# Altium project master.PrjPcb (part 1 of 4)
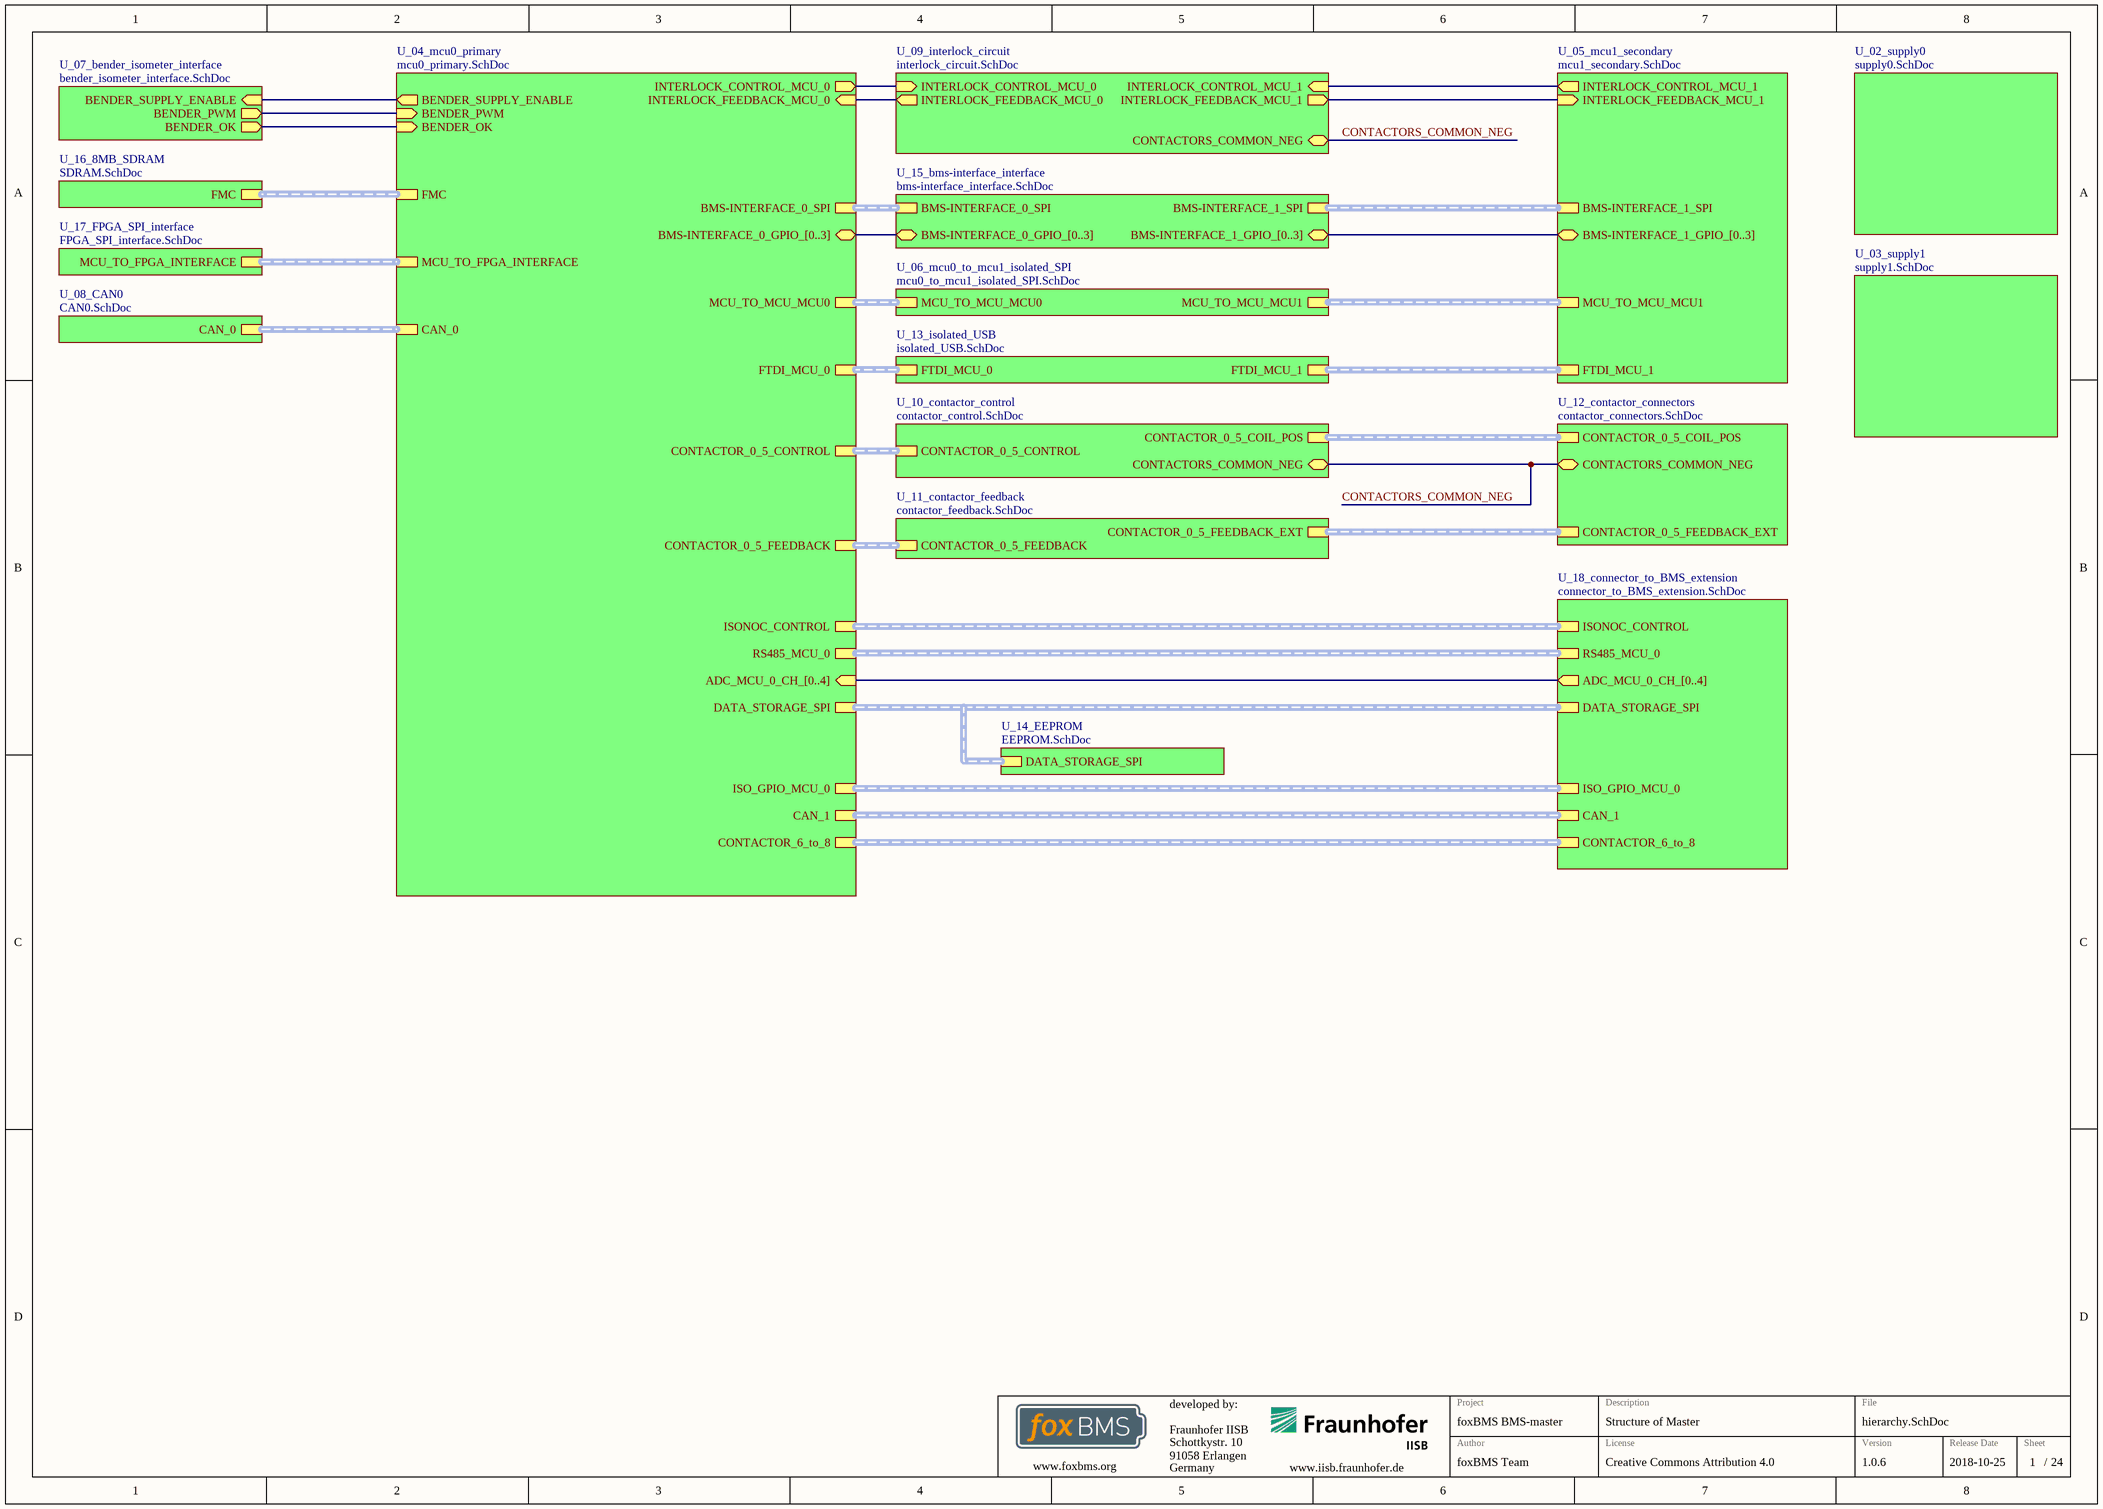
[diagram p0: hierarchy.SchDoc]
GlobalDate: 2018-10-25; GlobalLicense: Creative Commons Attribution 4.0; GlobalProject: foxBMS BMS-master; GlobalVersion: 1.0.6
24 sheets, 318 parts. Net scope: hierarchical (ports join the sheet entries above them; power ports are global).
Board file: master.PcbDoc
Sheets:
  hierarchy.SchDoc
    U_17_FPGA_SPI_interface = FPGA_SPI_interface.SchDoc
    U_02_supply0 = supply0.SchDoc
    U_03_supply1 = supply1.SchDoc
    U_04_mcu0_primary = mcu0_primary.SchDoc
      U_0403_crystals = crystals.SchDoc
      U_0404_debug_LED = debug_LED.SchDoc
      U_0405_ext_bootload_activation = ext_bootload_activation.SchDoc
      U_0400_power = power.SchDoc
        U_0401_adc_reference = adc_reference.SchDoc
        U_0402_analog_supply_decoupling = analog_supply_decoupling.SchDoc
    U_16_8MB_SDRAM = SDRAM.SchDoc
    U_08_CAN0 = CAN0.SchDoc
    U_06_mcu0_to_mcu1_isolated_SPI = mcu0_to_mcu1_isolated_SPI.SchDoc
    U_07_bender_isometer_interface = bender_isometer_interface.SchDoc
    U_13_isolated_USB = isolated_USB.SchDoc
    U_05_mcu1_secondary = mcu1_secondary.SchDoc
    U_18_connector_to_BMS_extension = connector_to_BMS_extension.SchDoc
    U_09_interlock_circuit = interlock_circuit.SchDoc
    U_10_contactor_control = contactor_control.SchDoc
    U_11_contactor_feedback = contactor_feedback.SchDoc
    U_12_contactor_connectors = contactor_connectors.SchDoc
    U_14_EEPROM = EEPROM.SchDoc
    U_15_bms-interface_interface = bms-interface_interface.SchDoc

## Sheet hierarchy.SchDoc
size A3; DocumentNumber: 1; SheetNumber: 1; SheetTotal: 24; SheetDescription: Structure of Master

### Sub-sheets
U_02_supply0 = supply0.SchDoc: no entries
U_03_supply1 = supply1.SchDoc: no entries
U_04_mcu0_primary = mcu0_primary.SchDoc: MCU_TO_FPGA_INTERFACE (harness SPI), FMC (harness FMC), CAN_1 (harness CAN), CAN_0 (harness CAN), MCU_TO_MCU_MCU0 (harness SPI), BENDER_SUPPLY_ENABLE (out), BENDER_PWM (in), BENDER_OK (in), FTDI_MCU_0 (harness FTDI), CONTACTOR_6_to_8 (harness CONTACTOR_6_to_8), INTERLOCK_FEEDBACK_MCU_0 (in), INTERLOCK_CONTROL_MCU_0 (out), DATA_STORAGE_SPI (harness DATA_STORAGE_SPI), CONTACTOR_0_5_FEEDBACK (harness CONTACTOR_0_TO_5), CONTACTOR_0_5_CONTROL (harness CONTACTOR_0_TO_5), BMS-INTERFACE_0_SPI (harness SPI), BMS-INTERFACE_0_GPIO_[0..3] (bidir, harness CAN), ADC_MCU_0_CH_[0..4] (in), RS485_MCU_0 (harness RS485), ISONOC_CONTROL (harness ISONOC_CONTROL), ISO_GPIO_MCU_0 (harness ISO_GPIO)
U_05_mcu1_secondary = mcu1_secondary.SchDoc: INTERLOCK_FEEDBACK_MCU_1 (in), INTERLOCK_CONTROL_MCU_1 (out), FTDI_MCU_1 (harness FTDI), MCU_TO_MCU_MCU1 (harness SPI), BMS-INTERFACE_1_SPI (harness SPI), BMS-INTERFACE_1_GPIO_[0..3] (bidir)
U_06_mcu0_to_mcu1_isolated_SPI = mcu0_to_mcu1_isolated_SPI.SchDoc: MCU_TO_MCU_MCU0 (harness SPI), MCU_TO_MCU_MCU1 (harness SPI)
U_07_bender_isometer_interface = bender_isometer_interface.SchDoc: BENDER_SUPPLY_ENABLE (in), BENDER_OK (out), BENDER_PWM (out)
U_08_CAN0 = CAN0.SchDoc: CAN_0 (harness CAN)
U_09_interlock_circuit = interlock_circuit.SchDoc: INTERLOCK_CONTROL_MCU_1 (in), INTERLOCK_FEEDBACK_MCU_0 (out), INTERLOCK_FEEDBACK_MCU_1 (out), CONTACTORS_COMMON_NEG (bidir), INTERLOCK_CONTROL_MCU_0 (in)
U_10_contactor_control = contactor_control.SchDoc: CONTACTORS_COMMON_NEG (bidir), CONTACTOR_0_5_COIL_POS (harness CONTACTOR_0_TO_5), CONTACTOR_0_5_CONTROL (harness CONTACTOR_0_TO_5)
U_11_contactor_feedback = contactor_feedback.SchDoc: CONTACTOR_0_5_FEEDBACK_EXT (harness CONTACTOR_0_TO_5), CONTACTOR_0_5_FEEDBACK (harness CONTACTOR_0_TO_5)
U_12_contactor_connectors = contactor_connectors.SchDoc: CONTACTORS_COMMON_NEG (bidir), CONTACTOR_0_5_COIL_POS (harness CONTACTOR_0_TO_5), CONTACTOR_0_5_FEEDBACK_EXT (harness CONTACTOR_0_TO_5)
U_13_isolated_USB = isolated_USB.SchDoc: FTDI_MCU_0 (harness FTDI), FTDI_MCU_1 (harness FTDI)
U_14_EEPROM = EEPROM.SchDoc: DATA_STORAGE_SPI (harness DATA_STORAGE_SPI)
U_15_bms-interface_interface = bms-interface_interface.SchDoc: BMS-INTERFACE_0_SPI (harness SPI), BMS-INTERFACE_1_SPI (harness SPI), BMS-INTERFACE_0_GPIO_[0..3] (bidir), BMS-INTERFACE_1_GPIO_[0..3] (bidir)
U_16_8MB_SDRAM = SDRAM.SchDoc: FMC (harness FMC)
U_17_FPGA_SPI_interface = FPGA_SPI_interface.SchDoc: MCU_TO_FPGA_INTERFACE (harness SPI)
U_18_connector_to_BMS_extension = connector_to_BMS_extension.SchDoc: CAN_1 (harness CAN), CONTACTOR_6_to_8 (harness CONTACTOR_6_to_8), DATA_STORAGE_SPI (harness DATA_STORAGE_SPI), ADC_MCU_0_CH_[0..4] (out), RS485_MCU_0 (harness RS485), ISONOC_CONTROL (harness ISONOC_CONTROL), ISO_GPIO_MCU_0 (harness ISO_GPIO)

### Nets
BENDER_OK: sheet U_04_mcu0_primary/BENDER_OK, sheet U_07_bender_isometer_interface/BENDER_OK
BENDER_PWM: sheet U_04_mcu0_primary/BENDER_PWM, sheet U_07_bender_isometer_interface/BENDER_PWM
BENDER_SUPPLY_ENABLE: sheet U_04_mcu0_primary/BENDER_SUPPLY_ENABLE, sheet U_07_bender_isometer_interface/BENDER_SUPPLY_ENABLE
CONTACTORS_COMMON_NEG: sheet U_09_interlock_circuit/CONTACTORS_COMMON_NEG, sheet U_10_contactor_control/CONTACTORS_COMMON_NEG, sheet U_12_contactor_connectors/CONTACTORS_COMMON_NEG
INTERLOCK_CONTROL_MCU_0: sheet U_04_mcu0_primary/INTERLOCK_CONTROL_MCU_0, sheet U_09_interlock_circuit/INTERLOCK_CONTROL_MCU_0
INTERLOCK_CONTROL_MCU_1: sheet U_05_mcu1_secondary/INTERLOCK_CONTROL_MCU_1, sheet U_09_interlock_circuit/INTERLOCK_CONTROL_MCU_1
INTERLOCK_FEEDBACK_MCU_0: sheet U_04_mcu0_primary/INTERLOCK_FEEDBACK_MCU_0, sheet U_09_interlock_circuit/INTERLOCK_FEEDBACK_MCU_0
INTERLOCK_FEEDBACK_MCU_1: sheet U_05_mcu1_secondary/INTERLOCK_FEEDBACK_MCU_1, sheet U_09_interlock_circuit/INTERLOCK_FEEDBACK_MCU_1

### Buses and harness runs
bus sheet U_04_mcu0_primary/ADC_MCU_0_CH_[0..4] = sheet U_18_connector_to_BMS_extension/ADC_MCU_0_CH_[0..4]
bus sheet U_05_mcu1_secondary/BMS-INTERFACE_1_GPIO_[0..3] = sheet U_15_bms-interface_interface/BMS-INTERFACE_1_GPIO_[0..3]
harness sheet U_04_mcu0_primary/BMS-INTERFACE_0_SPI = sheet U_15_bms-interface_interface/BMS-INTERFACE_0_SPI
harness sheet U_04_mcu0_primary/CAN_0 = sheet U_08_CAN0/CAN_0
harness sheet U_04_mcu0_primary/CAN_1 = sheet U_18_connector_to_BMS_extension/CAN_1
harness sheet U_04_mcu0_primary/CONTACTOR_0_5_CONTROL = sheet U_10_contactor_control/CONTACTOR_0_5_CONTROL
harness sheet U_04_mcu0_primary/CONTACTOR_0_5_FEEDBACK = sheet U_11_contactor_feedback/CONTACTOR_0_5_FEEDBACK
harness sheet U_04_mcu0_primary/CONTACTOR_6_to_8 = sheet U_18_connector_to_BMS_extension/CONTACTOR_6_to_8
harness sheet U_04_mcu0_primary/DATA_STORAGE_SPI = sheet U_14_EEPROM/DATA_STORAGE_SPI = sheet U_18_connector_to_BMS_extension/DATA_STORAGE_SPI
harness sheet U_04_mcu0_primary/FMC = sheet U_16_8MB_SDRAM/FMC
harness sheet U_04_mcu0_primary/FTDI_MCU_0 = sheet U_13_isolated_USB/FTDI_MCU_0
harness sheet U_04_mcu0_primary/ISO_GPIO_MCU_0 = sheet U_18_connector_to_BMS_extension/ISO_GPIO_MCU_0
harness sheet U_04_mcu0_primary/ISONOC_CONTROL = sheet U_18_connector_to_BMS_extension/ISONOC_CONTROL
harness sheet U_04_mcu0_primary/MCU_TO_FPGA_INTERFACE = sheet U_17_FPGA_SPI_interface/MCU_TO_FPGA_INTERFACE
harness sheet U_04_mcu0_primary/MCU_TO_MCU_MCU0 = sheet U_06_mcu0_to_mcu1_isolated_SPI/MCU_TO_MCU_MCU0
harness sheet U_04_mcu0_primary/RS485_MCU_0 = sheet U_18_connector_to_BMS_extension/RS485_MCU_0
harness sheet U_05_mcu1_secondary/BMS-INTERFACE_1_SPI = sheet U_15_bms-interface_interface/BMS-INTERFACE_1_SPI
harness sheet U_05_mcu1_secondary/FTDI_MCU_1 = sheet U_13_isolated_USB/FTDI_MCU_1
harness sheet U_05_mcu1_secondary/MCU_TO_MCU_MCU1 = sheet U_06_mcu0_to_mcu1_isolated_SPI/MCU_TO_MCU_MCU1
harness sheet U_10_contactor_control/CONTACTOR_0_5_COIL_POS = sheet U_12_contactor_connectors/CONTACTOR_0_5_COIL_POS
harness sheet U_11_contactor_feedback/CONTACTOR_0_5_FEEDBACK_EXT = sheet U_12_contactor_connectors/CONTACTOR_0_5_FEEDBACK_EXT

### Notes on the sheet
- Fraunhofer IISB
- Schottkystr. 10
- developed by:
- 91058 Erlangen
- Germany
- Author
- Project
- License
- Description
- File
- Version
- Release Date
- Sheet
- www.foxbms.org
- www.iisb.fraunhofer.de
- foxBMS Team
- /

## Sheet FPGA_SPI_interface.SchDoc: foxBMS BMS-Master
size A3; DocumentNumber: 23; SheetNumber: 23; SheetTotal: 24; Author: Fraunhofer IISB foxBMS Team; REL-DATE: 2017-05-16; VERSION: 1.0.2; SheetDescription: FPGA SPI Interface up to 45MHz
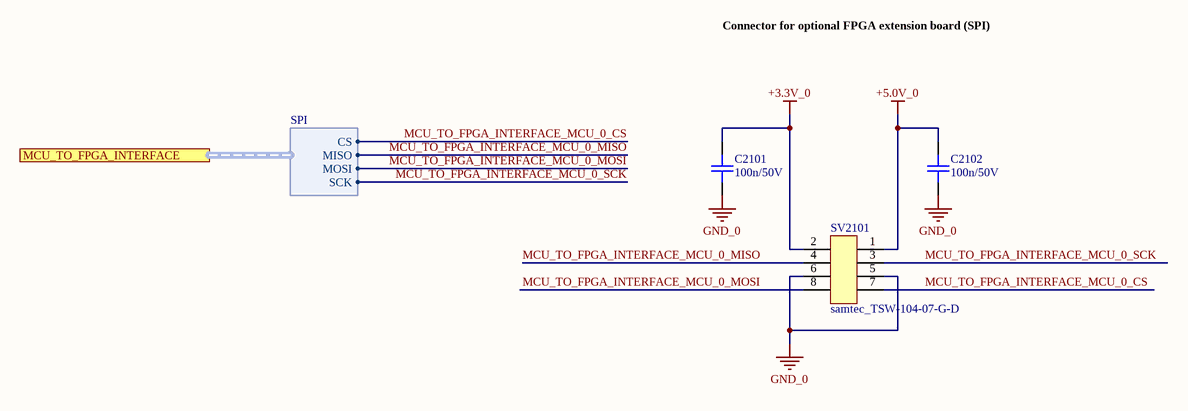
[diagram p1: FPGA_SPI_interface.SchDoc]

### Parts
C2101  100n/50V  [CAPC1608X08N]
C2102  100n/50V  [CAPC1608X08N]
SV2101  samtec_TSW-104-07-G-D  [Pinheader_2.54_2x4]

### Ports
MCU_TO_FPGA_INTERFACE (harness SPI)

### Harnesses
SPI: CS, MISO, MOSI, SCK

### Nets
+3.3V_0: C2101.2 SV2101.2
+5.0V_0: C2102.1 SV2101.1
GND_0: C2101.1 C2102.2 SV2101.5 SV2101.6
MCU_TO_FPGA_INTERFACE_MCU_0_CS: SV2101.7 ; port MCU_TO_FPGA_INTERFACE.CS
MCU_TO_FPGA_INTERFACE_MCU_0_MISO: SV2101.4 ; port MCU_TO_FPGA_INTERFACE.MISO
MCU_TO_FPGA_INTERFACE_MCU_0_MOSI: SV2101.8 ; port MCU_TO_FPGA_INTERFACE.MOSI
MCU_TO_FPGA_INTERFACE_MCU_0_SCK: SV2101.3 ; port MCU_TO_FPGA_INTERFACE.SCK

### Notes on the sheet
- Connector for optional FPGA extension board (SPI)
- Fraunhofer IISB
- Schottkystr. 10
- developed by:
- 91058 Erlangen
- Germany
- Author
- Project
- License
- Description
- File
- Version
- Release Date
- Sheet
- www.foxbms.org
- www.iisb.fraunhofer.de
- foxBMS Team
- /

### Library data of the parts
C2101 C2102 = gen_C_ceramic_100n_50V_X7R_0603: MLCC; Capacitance: 100n; Rated Voltage: 50V; Dielectric: X7R; Case EIA: 0603; Case Metric: 1608; PnP Package: C_0603_10; PnP Value: 100n/50V/X7R; PnP equipped: x; Automotive Qualified: False; Part Number: gen_C_ceramic_100n_50V_X7R_0603; Supplier 1: Farnell; Supplier Part Number 1: 2525267; Supplier 2: Digikey; Supplier Part Number 2: 490-6049-1-ND
SV2101 = samtec_TSW-104-07-G-D: Board-To-Board Connector, Vertical, 2.54 mm, 8 Contacts, Header, TSW Series, Through Hole, 2 Rows; Manufacturer: Samtec; Circuits: 8; Rated Voltage: 500V AC mated with SSW; Automotive Qualified: False; Part Number: samtec_TSW-104-07-G-D; Part Name: TSW-104-07-G-D; Operating Temperature: -55°C - +125°C; ComponentLink1Description: Datasheet; ComponentLink1URL: http://www.farnell.com/datasheets/1992055.pdf; Supplier 1: Farnell; Supplier Part Number 1: 2025250

## Sheet supply0.SchDoc: foxBMS BMS-Master
size A3; DocumentNumber: 2; SheetNumber: 2; SheetTotal: 24; Author: Fraunhofer IISB foxBMS Team; REL-DATE: 2017-05-16; VERSION: 1.0.2; SheetDescription: Supply for MCU0 and peripherals
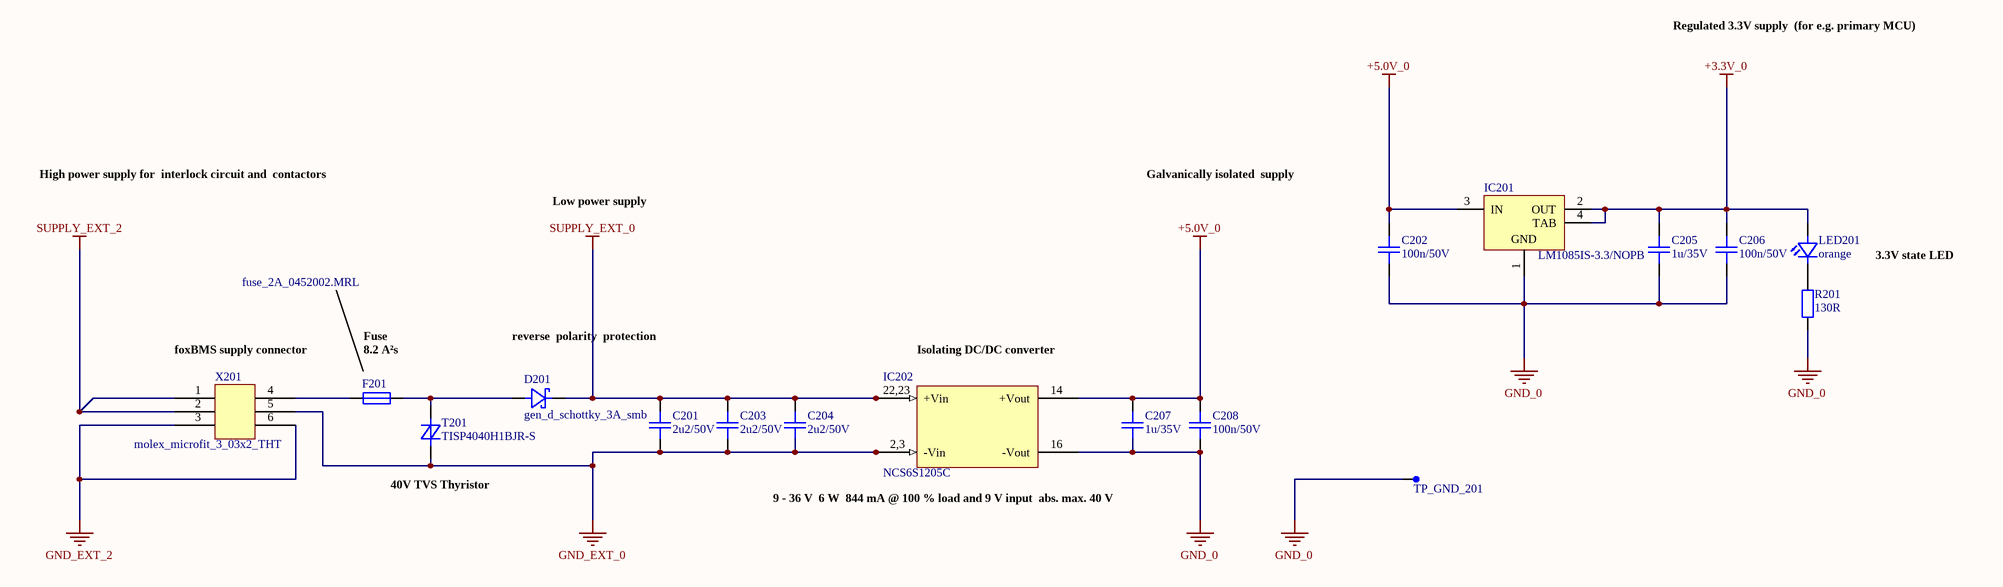
[diagram p2: supply0.SchDoc]

### Parts
C201  2u2/50V  [CAPC2012X14N]
C202  100n/50V  [CAPC1608X08N]
C203  2u2/50V  [CAPC2012X14N]
C204  2u2/50V  [CAPC2012X14N]
C205  1u/35V  [CAPC1608X08N]
C206  100n/50V  [CAPC1608X08N]
C207  1u/35V  [CAPC1608X08N]
C208  100n/50V  [CAPC1608X08N]
D201  gen_d_schottky_3A_smb  [SMB]
F201  fuse_2A_0452002.MRL  [LITTLEFUSE_452_454]
IC201  LM1085IS-3.3/NOPB  [KTT0003B_N]
IC202  NCS6S1205C  [NCS6S1205C]
LED201  orange  [LEDC1608X07N]
R201  130R  [RESC1608X05N]
T201  TISP4040H1BJR-S  [SMB]
TP_GND_201  Testpoint_Round  [Testpoint_D1V]  (value not drawn)  (no BOM)
X201  molex_microfit_3_03x2_THT  [MOLEX_MICROFIT_03x2_THT]

### Nets
+3.3V_0: C205.1 C206.1 IC201.2(OUT) IC201.4(TAB) LED201.2(A)
+5.0V_0: C202.1 C207.1 C208.1 IC201.3(IN) IC202.14(+Vout)
GND_0: C202.2 C205.2 C206.2 C207.2 C208.2 IC201.1(GND) IC202.16(-Vout) R201.1 TP_GND_201.1
GND_EXT_0: C201.2 C203.2 C204.2 IC202.2(-Vin) IC202.3(-Vin) T201.2(T(A)) X201.5
GND_EXT_2: X201.3 X201.6
SUPPLY_EXT_0: C201.1 C203.1 C204.1 D201.1(K) IC202.22(+Vin) IC202.23(+Vin)
SUPPLY_EXT_2: X201.1 X201.2
NetD201_2: D201.2(A) F201.2 T201.1(R(B))
NetF201_1: F201.1 X201.4
NetLED201_1: LED201.1(C) R201.2

### Notes on the sheet
- Regulated 3.3V supply
  (for e.g. primary MCU)
- High power supply for
  interlock circuit and
  contactors
- Galvanically isolated
  supply
- Low power supply
- 3.3V state LED
- foxBMS supply connector
- Fuse
- (near F201) 8.2 A²s
- reverse
  polarity
  protection
- (near IC202) Isolating DC/DC converter
- (near T201) 40V TVS Thyristor
- 9 - 36 V
  6 W
  844 mA @ 100 % load and 9 V input
  abs. max. 40 V
- Fraunhofer IISB
- Schottkystr. 10
- developed by:
- 91058 Erlangen
- Germany
- Author
- Project
- License
- Description
- File
- Version
- Release Date
- Sheet
- www.foxbms.org
- www.iisb.fraunhofer.de
- foxBMS Team
- /
- (in symbol NCS6S1205C) 22,23; 2,3

### Library data of the parts
C201 C203 C204 = gen_C_ceramic_2u2_50V_X7R_0805: MLCC; Capacitance: 2u2; Rated Voltage: 50V; Dielectric: X7R; Case EIA: 0805; Case Metric: 2012; Automotive Qualified: False; Part Number: gen_C_ceramic_2u2_50V_X7R_0805; Supplier 1: Farnell; Supplier Part Number 1: 2547054
C202 C206 C208 = gen_C_ceramic_100n_50V_X7R_0603: as C2101 on sheet FPGA_SPI_interface; Part Number: gen_C_ceramic_100n_50V_X7R_0603; Supplier 1: Farnell; Supplier Part Number 1: 2525267; Supplier 2: Digikey; Supplier Part Number 2: 490-6049-1-ND
C205 C207 = gen_C_ceramic_1u_35V_X7R_0603: MLCC; Capacitance: 1u; Rated Voltage: 35V; Dielectric: X7R; Case EIA: 0603; Case Metric: 1608; PnP Package: C_0603_10; PnP Value: 1uF/35V/X7R; PnP equipped: x; Automotive Qualified: False; Part Number: gen_C_ceramic_1u_35V_X7R_0603; Supplier 1: Farnell; Supplier Part Number 1: 1907508
D201 = gen_d_schottky_3A_smb: Schottky Diode; Part Name: e.g. STPS3L60U; Manufacturer: e.g. ST Microelectronics; Continuous Forward Current: 3A; Automotive Qualified: False; Part Number: gen_d_schottky_3A_smb; ComponentLink1Description: Datasheet; ComponentLink1URL: http://www.farnell.com/datasheets/1671123.pdf; Supplier 1: Farnell; Supplier Part Number 1: 9907769
F201 = fuse_2A_0452002.MRL: Littlefuse NANO SLO-BLO Fuse 2A 8.20A²s 0452002.MRL; Automotive Qualified: False; Part Number: fuse_2A_0452002.MRL; Manufacturer: Littlefuse; Operating Temperature: -55°C - +125°C; ComponentLink1Description: Datasheet; ComponentLink1URL: http://www.farnell.com/datasheets/2108446.pdf; Supplier 1: Farnell; Supplier Part Number 1: 2383284
IC201 = CMP-0062-00578-5: 3A Low Dropout Positive Regulators, 3-pin TO-263, Pb-Free; Manufacturer: Texas Instruments; High-Reliability: Y; PowerWise: N; CompType: LDO IC; PackageTopMarking: NSUZXYTTE#*LM1085*IS-3.3; PartNumber: LM1085IS-3.3/NOPB; ComponentLink1Description: Datasheet URL; Code_JEDEC: MO-169-AA; PinCount: 3; RoHS: Y; PackageReference: KTT0003B; ComponentLink1URL: http://www.ti.com/general/docs/lit/getliterature.tsp?genericPartNumber=LM1085&fileType=pdf; PackageDescription: TO-263, Molded, .400 x .390 x .180in, 3 Lead, .1in Pitch, Surface Mount
IC202 = NCS6S1205C: Murata Isolated 6W 4:1 Input Single Output DC/DC Converter; Manufacturer: Murata Power Solutions Inc.; Automotive Qualified: False; Part Number: NCS6S1205C; Operating Temperature: -40°C - +85°C; ComponentLink1Description: Datasheet; ComponentLink1URL: https://power.murata.com/data/power/ncl/kdc_ncs6.pdf; ComponentLink2Description: 3D PDF; ComponentLink2URL: https://power.murata.com/3d/dcdc/mps_dcdc_ncs6s_a.pdf; Supplier 1: Digikey; Supplier Part Number 1: 811-2109-5-ND
LED201 = gen_LED_0603_orange: LED; Breakdown Voltage: 5V; Continuous Forward Current: 20mA; Forward Voltage @ 20mA: 2.2V; Automotive Qualified: False; Part Number: gen_LED_0603_orange; Color: orange; PnP Package: LED_0603; Supplier 1: Farnell; Supplier Part Number 1: 2099222
R201 = gen_R_130R_0603: SMD Resistor 130R 0603; Tolerance: 1%; Power: 0.1W; Case EIA: 0603; Case Metric: 1608; Maximum Working Voltage: 75V; PnP Package: R_0603; Automotive Qualified: False; Part Number: gen_R_130R_0603; Operating Temperature: -55°C - +155°C; Resistance: 130R; Series: E24, E96; PnP Value: 130R; Supplier 1: Farnell; Supplier Part Number 1: 2379959
T201 = TISP4040H1BJR-S: BIDIRECTIONAL THYRISTOR OVERVOLTAGE PROTECTOR; Manufacturer: Bourns; Automotive Qualified: False; Part Number: TISP4040H1BJR-S; Operating Temperature: -40°C - +150°C; ComponentLink1Description: Datasheet; ComponentLink1URL: http://www.bourns.com/data/global/pdfs/TISP40xxH1BJ.pdf; Supplier 1: Digikey; Supplier Part Number 1: TISP4040H1BJR-SCT-ND
TP_GND_201 = Testpoint_Round_Via: Testpoint, Via, round; Part Number: Testpoint_Round_Via
X201 = molex_microfit_3_03x2_THT: Micro-Fit 3.0 Right Angle Header, 3.00mm Pitch, Dual Row, 6 Circuits, with Snap-in Plastic Peg PCB Lock, Tin, Glow Wire Capable, Black, 43045-0600; Manufacturer: Molex; Circuits: 6; Rated Voltage: 600V; Rated Current: 8.5A; Automotive Qualified: False; Part Number: molex_microfit_3_03x2_THT; Part Name: MicroFit; Operating Temperature: -40°C - +105°C; Supplier 1: Farnell; Supplier Part Number 1: 1012252

## Sheet supply1.SchDoc: foxBMS BMS-Master
size A3; DocumentNumber: 3; SheetNumber: 3; SheetTotal: 24; Author: Fraunhofer IISB foxBMS Team; REL-DATE: 2017-05-16; VERSION: 1.0.2; SheetDescription: Supply for MCU1 and peripherals
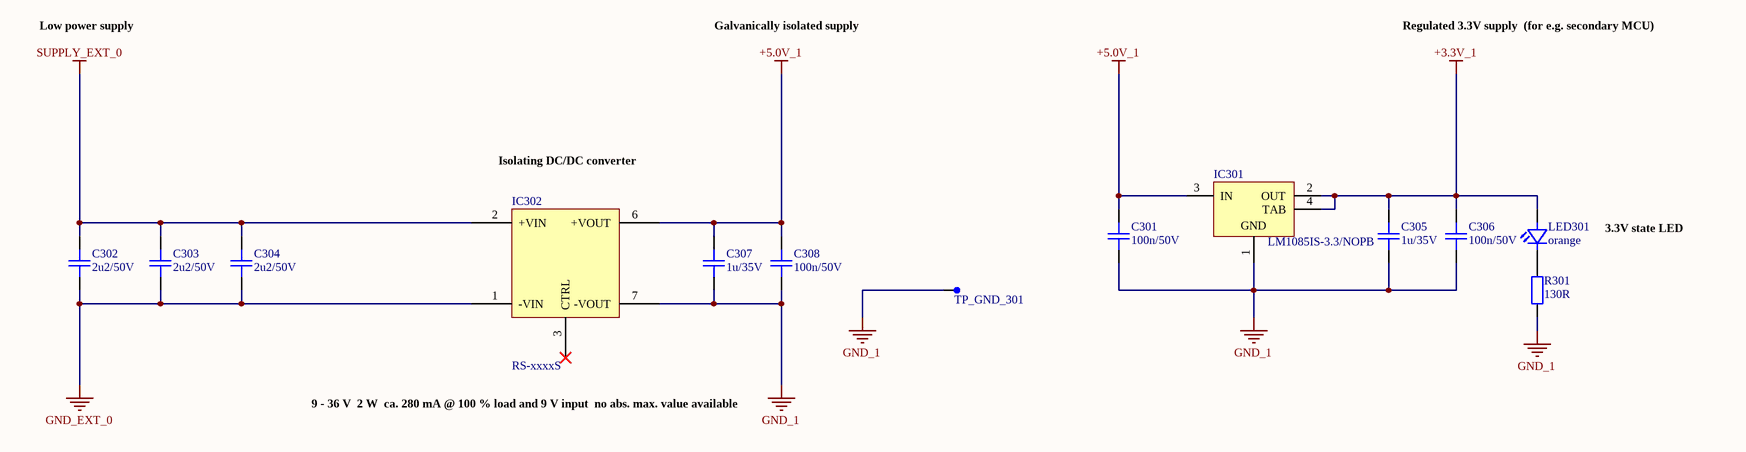
[diagram p3: supply1.SchDoc]

### Parts
C301  100n/50V  [CAPC1608X08N]
C302  2u2/50V  [CAPC2012X14N]
C303  2u2/50V  [CAPC2012X14N]
C304  2u2/50V  [CAPC2012X14N]
C305  1u/35V  [CAPC1608X08N]
C306  100n/50V  [CAPC1608X08N]
C307  1u/35V  [CAPC1608X08N]
C308  100n/50V  [CAPC1608X08N]
IC301  LM1085IS-3.3/NOPB  [KTT0003B_N]
IC302  RS-xxxxS  [RECOM_RS-S_D]
LED301  orange  [LEDC1608X07N]
R301  130R  [RESC1608X05N]
TP_GND_301  Testpoint_Round  [Testpoint_D1V]  (value not drawn)  (no BOM)

### Nets
+3.3V_1: C305.1 C306.1 IC301.2(OUT) IC301.4(TAB) LED301.2(A)
+5.0V_1: C301.1 C307.1 C308.1 IC301.3(IN) IC302.6(+VOUT)
GND_1: C301.2 C305.2 C306.2 C307.2 C308.2 IC301.1(GND) IC302.7(-VOUT) R301.2 TP_GND_301.1
GND_EXT_0: C302.2 C303.2 C304.2 IC302.1(-VIN)
SUPPLY_EXT_0: C302.1 C303.1 C304.1 IC302.2(+VIN)
NetLED301_1: LED301.1(C) R301.1

Not connected (* = marked no-connect by the designer): IC302 3(CTRL)*

### Notes on the sheet
- Low power supply
- Galvanically isolated supply
- Regulated 3.3V supply
  (for e.g. secondary MCU)
- Isolating DC/DC converter
- 3.3V state LED
- 9 - 36 V
  2 W
  ca. 280 mA @ 100 % load and 9 V input
  no abs. max. value available
- Fraunhofer IISB
- Schottkystr. 10
- developed by:
- 91058 Erlangen
- Germany
- Author
- Project
- License
- Description
- File
- Version
- Release Date
- Sheet
- www.foxbms.org
- www.iisb.fraunhofer.de
- foxBMS Team
- /

### Library data of the parts
C301 C306 C308 = gen_C_ceramic_100n_50V_X7R_0603: as C2101 on sheet FPGA_SPI_interface; Part Number: gen_C_ceramic_100n_50V_X7R_0603; Supplier 1: Farnell; Supplier Part Number 1: 2525267; Supplier 2: Digikey; Supplier Part Number 2: 490-6049-1-ND
C302-C304 = gen_C_ceramic_2u2_50V_X7R_0805: as C201 on sheet supply0; Part Number: gen_C_ceramic_2u2_50V_X7R_0805; Supplier 1: Farnell; Supplier Part Number 1: 2547054
C305 C307 = gen_C_ceramic_1u_35V_X7R_0603: as C205 on sheet supply0; Part Number: gen_C_ceramic_1u_35V_X7R_0603; Supplier 1: Farnell; Supplier Part Number 1: 1907508
IC301 = CMP-0062-00578-5: as IC201 on sheet supply0; PartNumber: LM1085IS-3.3/NOPB; ComponentLink1Description: Datasheet URL; Code_JEDEC: MO-169-AA; PinCount: 3; RoHS: Y; PackageReference: KTT0003B; ComponentLink1URL: http://www.ti.com/general/docs/lit/getliterature.tsp?genericPartNumber=LM1085&fileType=pdf; PackageDescription: TO-263, Molded, .400 x .390 x .180in, 3 Lead, .1in Pitch, Surface Mount
IC302 = Recom_RS-2405SZ/H3: Isolating DC/DC Converter; Manufacturer: Recom; Automotive Qualified: False; Part Number: Recom_RS-2405SZ/H3; ComponentLink1Description: Datasheet; ComponentLink1URL: https://www.recom-power.com/pdf/Econoline/RS-S_D_Z.pdf; Supplier 1: Digikey; Supplier Part Number 1: 945-1552-5-ND; Supplier 2: Farnell; Supplier Part Number 2: 1893731; Supplier 3: Mouser; Supplier Part Number 3: 919-RS-2405SZ/H3
LED301 = gen_LED_0603_orange: as LED201 on sheet supply0; Part Number: gen_LED_0603_orange; Color: orange; PnP Package: LED_0603; Supplier 1: Farnell; Supplier Part Number 1: 2099222
R301 = gen_R_130R_0603: as R201 on sheet supply0; Part Number: gen_R_130R_0603; Operating Temperature: -55°C - +155°C; Resistance: 130R; Series: E24, E96; PnP Value: 130R; Supplier 1: Farnell; Supplier Part Number 1: 2379959
TP_GND_301 = Testpoint_Round_Via: Testpoint, Via, round; Part Number: Testpoint_Round_Via

## Sheet mcu0_primary.SchDoc: foxBMS BMS-Master
size A3; DocumentNumber: 4; SheetNumber: 4; SheetTotal: 24; Author: Fraunhofer IISB foxBMS Team; REL-DATE: 2017-05-16; VERSION: 1.0.2; SheetDescription: MCU0 (Primary)
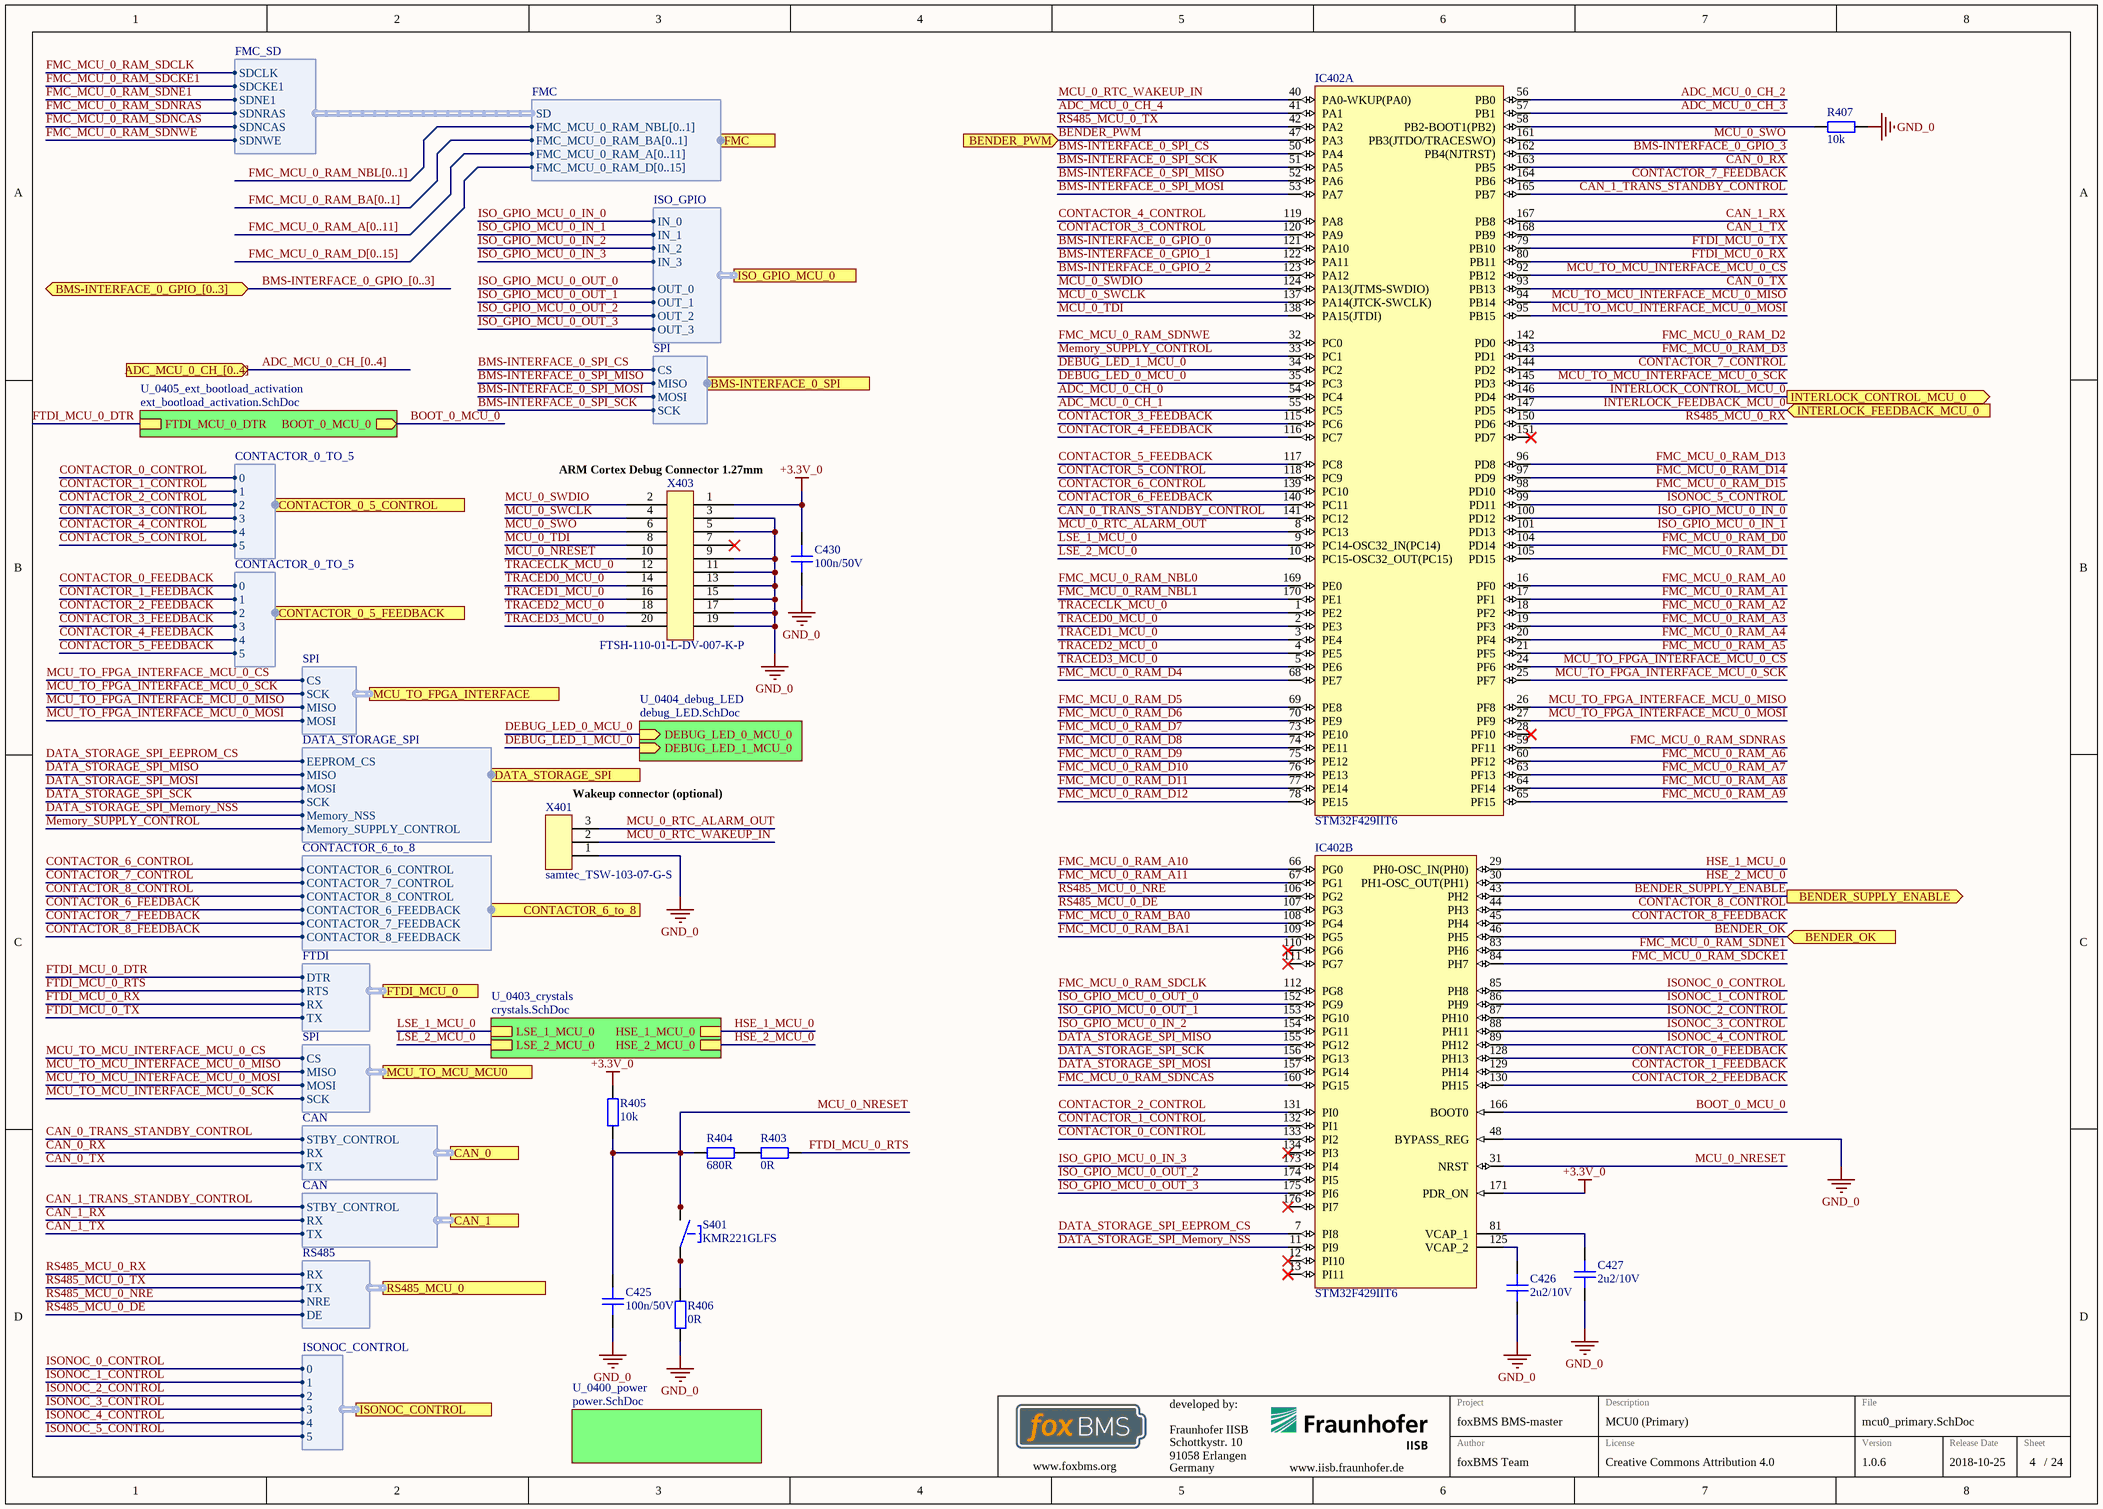
[diagram p4: mcu0_primary.SchDoc]

### Parts
C425  100n/50V  [CAPC1608X08N]
C426  2u2/10V  [CAPC1608X08N]
C427  2u2/10V  [CAPC1608X08N]
C430  100n/50V  [CAPC1608X08N]
IC402  STM32F429IIT6  [STM-LQFP176_N]  (parts A,B of 3)
R403  0R  [RESC1608X05N]
R404  680R  [RESC1608X05N]
R405  10k  [RESC1608X05N]
R406  0R  [RESC1608X05N]
R407  10k  [RESC1608X05N]
S401  KMR221GLFS  [KMR2_Series]
X401  samtec_TSW-103-07-G-S  [Pinheader_2.54_3]
X403  FTSH-110-01-L-DV-007-K-P  [CORTEX_DEBUG_20_PIN]

### Sub-sheets
U_0400_power = power.SchDoc: no entries
U_0403_crystals = crystals.SchDoc: LSE_1_MCU_0, LSE_2_MCU_0, HSE_1_MCU_0, HSE_2_MCU_0
U_0404_debug_LED = debug_LED.SchDoc: DEBUG_LED_0_MCU_0 (in), DEBUG_LED_1_MCU_0 (in)
U_0405_ext_bootload_activation = ext_bootload_activation.SchDoc: FTDI_MCU_0_DTR, BOOT_0_MCU_0 (out)

### Ports
ADC_MCU_0_CH_[0..4] (in), BENDER_OK (in), BENDER_PWM (in), BENDER_SUPPLY_ENABLE (out), BMS-INTERFACE_0_GPIO_[0..3] (bidir, harness CAN), BMS-INTERFACE_0_SPI (harness SPI), CAN_0 (harness CAN), CAN_1 (harness CAN), CONTACTOR_0_5_CONTROL (harness CONTACTOR_0_TO_5), CONTACTOR_0_5_FEEDBACK (harness CONTACTOR_0_TO_5), CONTACTOR_6_to_8 (harness CONTACTOR_6_to_8), DATA_STORAGE_SPI (harness DATA_STORAGE_SPI), FMC (harness FMC), FTDI_MCU_0 (harness FTDI), INTERLOCK_CONTROL_MCU_0 (out), INTERLOCK_FEEDBACK_MCU_0 (in), ISO_GPIO_MCU_0 (harness ISO_GPIO), ISONOC_CONTROL (harness ISONOC_CONTROL), MCU_TO_FPGA_INTERFACE (harness SPI), MCU_TO_MCU_MCU0 (harness SPI), RS485_MCU_0 (harness RS485)

### Harnesses
FMC_SD: SDCLK, SDCKE1, SDNE1, SDNRAS, SDNWE, SDNCAS
FMC: SD, FMC_MCU_0_RAM_NBL[0..1], FMC_MCU_0_RAM_BA[0..1], FMC_MCU_0_RAM_A[0..11], FMC_MCU_0_RAM_D[0..15]
SPI: CS, SCK, MISO, MOSI
DATA_STORAGE_SPI: EEPROM_CS, MISO, MOSI, SCK, Memory_NSS, Memory_SUPPLY_CONTROL
CONTACTOR_6_to_8: CONTACTOR_6_CONTROL, CONTACTOR_7_CONTROL, CONTACTOR_8_CONTROL, CONTACTOR_6_FEEDBACK, CONTACTOR_7_FEEDBACK, CONTACTOR_8_FEEDBACK
SPI: CS, MISO, MOSI, SCK
FTDI: DTR, RTS, RX, TX
CAN: STBY_CONTROL, RX, TX
RS485: RX, TX, NRE, DE
ISONOC_CONTROL: 0, 1, 2, 3, 4, 5
ISO_GPIO: IN_0, IN_1, IN_2, IN_3, OUT_3, OUT_0, OUT_1, OUT_2
CONTACTOR_0_TO_5: 0, 1, 2, 3, 4, 5

### Nets
+3.3V_0: C430.1 IC402.171(PDR_ON) R405.2 X403.1
GND_0: C425.2 C426.2 C427.2 C430.2 IC402.48(BYPASS_REG) R406.1 R407.1 X401.1 X403.3 X403.5 X403.9 X403.11 X403.13 X403.15 X403.17 X403.19
ADC_MCU_0_CH_0: IC402.54(PC4)
ADC_MCU_0_CH_1: IC402.55(PC5)
ADC_MCU_0_CH_2: IC402.56(PB0)
ADC_MCU_0_CH_3: IC402.57(PB1)
ADC_MCU_0_CH_4: IC402.41(PA1)
BENDER_OK: IC402.46(PH5) ; port BENDER_OK
BENDER_PWM: IC402.47(PA3) ; port BENDER_PWM
BENDER_SUPPLY_ENABLE: IC402.43(PH2) ; port BENDER_SUPPLY_ENABLE
BMS-INTERFACE_0_GPIO_0: IC402.121(PA10)
BMS-INTERFACE_0_GPIO_1: IC402.122(PA11)
BMS-INTERFACE_0_GPIO_2: IC402.123(PA12)
BMS-INTERFACE_0_GPIO_3: IC402.162(PB4(NJTRST))
BMS-INTERFACE_0_SPI_CS: IC402.50(PA4) ; port BMS-INTERFACE_0_SPI.CS
BMS-INTERFACE_0_SPI_MISO: IC402.52(PA6) ; port BMS-INTERFACE_0_SPI.MISO
BMS-INTERFACE_0_SPI_MOSI: IC402.53(PA7) ; port BMS-INTERFACE_0_SPI.MOSI
BMS-INTERFACE_0_SPI_SCK: IC402.51(PA5) ; port BMS-INTERFACE_0_SPI.SCK
BOOT_0_MCU_0: IC402.166(BOOT0) ; sheet U_0405_ext_bootload_activation/BOOT_0_MCU_0
CAN_0_RX: IC402.163(PB5) ; port CAN_0.RX
CAN_0_TRANS_STANDBY_CONTROL: IC402.141(PC12) ; port CAN_0.STBY_CONTROL
CAN_0_TX: IC402.93(PB13) ; port CAN_0.TX
CAN_1_RX: IC402.167(PB8) ; port CAN_1.RX
CAN_1_TRANS_STANDBY_CONTROL: IC402.165(PB7) ; port CAN_1.STBY_CONTROL
CAN_1_TX: IC402.168(PB9) ; port CAN_1.TX
CONTACTOR_0_CONTROL: IC402.133(PI2) ; port CONTACTOR_0_5_CONTROL.0
CONTACTOR_0_FEEDBACK: IC402.128(PH13) ; port CONTACTOR_0_5_FEEDBACK.0
CONTACTOR_1_CONTROL: IC402.132(PI1) ; port CONTACTOR_0_5_CONTROL.1
CONTACTOR_1_FEEDBACK: IC402.129(PH14) ; port CONTACTOR_0_5_FEEDBACK.1
CONTACTOR_2_CONTROL: IC402.131(PI0) ; port CONTACTOR_0_5_CONTROL.2
CONTACTOR_2_FEEDBACK: IC402.130(PH15) ; port CONTACTOR_0_5_FEEDBACK.2
CONTACTOR_3_CONTROL: IC402.120(PA9) ; port CONTACTOR_0_5_CONTROL.3
CONTACTOR_3_FEEDBACK: IC402.115(PC6) ; port CONTACTOR_0_5_FEEDBACK.3
CONTACTOR_4_CONTROL: IC402.119(PA8) ; port CONTACTOR_0_5_CONTROL.4
CONTACTOR_4_FEEDBACK: IC402.116(PC7) ; port CONTACTOR_0_5_FEEDBACK.4
CONTACTOR_5_CONTROL: IC402.118(PC9) ; port CONTACTOR_0_5_CONTROL.5
CONTACTOR_5_FEEDBACK: IC402.117(PC8) ; port CONTACTOR_0_5_FEEDBACK.5
CONTACTOR_6_CONTROL: IC402.139(PC10) ; port CONTACTOR_6_to_8.CONTACTOR_6_CONTROL
CONTACTOR_6_FEEDBACK: IC402.140(PC11) ; port CONTACTOR_6_to_8.CONTACTOR_6_FEEDBACK
CONTACTOR_7_CONTROL: IC402.144(PD2) ; port CONTACTOR_6_to_8.CONTACTOR_7_CONTROL
CONTACTOR_7_FEEDBACK: IC402.164(PB6) ; port CONTACTOR_6_to_8.CONTACTOR_7_FEEDBACK
CONTACTOR_8_CONTROL: IC402.44(PH3) ; port CONTACTOR_6_to_8.CONTACTOR_8_CONTROL
CONTACTOR_8_FEEDBACK: IC402.45(PH4) ; port CONTACTOR_6_to_8.CONTACTOR_8_FEEDBACK
DATA_STORAGE_SPI_EEPROM_CS: IC402.7(PI8) ; port DATA_STORAGE_SPI.EEPROM_CS
DATA_STORAGE_SPI_Memory_NSS: IC402.11(PI9) ; port DATA_STORAGE_SPI.Memory_NSS
DATA_STORAGE_SPI_MISO: IC402.155(PG12) ; port DATA_STORAGE_SPI.MISO
DATA_STORAGE_SPI_MOSI: IC402.157(PG14) ; port DATA_STORAGE_SPI.MOSI
DATA_STORAGE_SPI_SCK: IC402.156(PG13) ; port DATA_STORAGE_SPI.SCK
DEBUG_LED_0_MCU_0: IC402.35(PC3) ; sheet U_0404_debug_LED/DEBUG_LED_0_MCU_0
DEBUG_LED_1_MCU_0: IC402.34(PC2) ; sheet U_0404_debug_LED/DEBUG_LED_1_MCU_0
FMC_MCU_0_RAM_A0: IC402.16(PF0)
FMC_MCU_0_RAM_A1: IC402.17(PF1)
FMC_MCU_0_RAM_A2: IC402.18(PF2)
FMC_MCU_0_RAM_A3: IC402.19(PF3)
FMC_MCU_0_RAM_A4: IC402.20(PF4)
FMC_MCU_0_RAM_A5: IC402.21(PF5)
FMC_MCU_0_RAM_A6: IC402.60(PF12)
FMC_MCU_0_RAM_A7: IC402.63(PF13)
FMC_MCU_0_RAM_A8: IC402.64(PF14)
FMC_MCU_0_RAM_A9: IC402.65(PF15)
FMC_MCU_0_RAM_A10: IC402.66(PG0)
FMC_MCU_0_RAM_A11: IC402.67(PG1)
FMC_MCU_0_RAM_BA0: IC402.108(PG4)
FMC_MCU_0_RAM_BA1: IC402.109(PG5)
FMC_MCU_0_RAM_D0: IC402.104(PD14)
FMC_MCU_0_RAM_D1: IC402.105(PD15)
FMC_MCU_0_RAM_D2: IC402.142(PD0)
FMC_MCU_0_RAM_D3: IC402.143(PD1)
FMC_MCU_0_RAM_D4: IC402.68(PE7)
FMC_MCU_0_RAM_D5: IC402.69(PE8)
FMC_MCU_0_RAM_D6: IC402.70(PE9)
FMC_MCU_0_RAM_D7: IC402.73(PE10)
FMC_MCU_0_RAM_D8: IC402.74(PE11)
FMC_MCU_0_RAM_D9: IC402.75(PE12)
FMC_MCU_0_RAM_D10: IC402.76(PE13)
FMC_MCU_0_RAM_D11: IC402.77(PE14)
FMC_MCU_0_RAM_D12: IC402.78(PE15)
FMC_MCU_0_RAM_D13: IC402.96(PD8)
FMC_MCU_0_RAM_D14: IC402.97(PD9)
FMC_MCU_0_RAM_D15: IC402.98(PD10)
FMC_MCU_0_RAM_NBL0: IC402.169(PE0)
FMC_MCU_0_RAM_NBL1: IC402.170(PE1)
FMC_MCU_0_RAM_SDCKE1: IC402.84(PH7) ; harness FMC_SD.SDCKE1
FMC_MCU_0_RAM_SDCLK: IC402.112(PG8) ; harness FMC_SD.SDCLK
FMC_MCU_0_RAM_SDNCAS: IC402.160(PG15) ; harness FMC_SD.SDNCAS
FMC_MCU_0_RAM_SDNE1: IC402.83(PH6) ; harness FMC_SD.SDNE1
FMC_MCU_0_RAM_SDNRAS: IC402.59(PF11) ; harness FMC_SD.SDNRAS
FMC_MCU_0_RAM_SDNWE: IC402.32(PC0) ; harness FMC_SD.SDNWE
FTDI_MCU_0_DTR: sheet U_0405_ext_bootload_activation/FTDI_MCU_0_DTR, port FTDI_MCU_0.DTR
FTDI_MCU_0_RTS: R403.2 ; port FTDI_MCU_0.RTS
FTDI_MCU_0_RX: IC402.80(PB11) ; port FTDI_MCU_0.RX
FTDI_MCU_0_TX: IC402.79(PB10) ; port FTDI_MCU_0.TX
HSE_1_MCU_0: IC402.29(PH0-OSC_IN(PH0)) ; sheet U_0403_crystals/HSE_1_MCU_0
HSE_2_MCU_0: IC402.30(PH1-OSC_OUT(PH1)) ; sheet U_0403_crystals/HSE_2_MCU_0
INTERLOCK_CONTROL_MCU_0: IC402.146(PD4) ; port INTERLOCK_CONTROL_MCU_0
INTERLOCK_FEEDBACK_MCU_0: IC402.147(PD5) ; port INTERLOCK_FEEDBACK_MCU_0
ISO_GPIO_MCU_0_IN_0: IC402.100(PD12) ; port ISO_GPIO_MCU_0.IN_0
ISO_GPIO_MCU_0_IN_1: IC402.101(PD13) ; port ISO_GPIO_MCU_0.IN_1
ISO_GPIO_MCU_0_IN_2: IC402.154(PG11) ; port ISO_GPIO_MCU_0.IN_2
ISO_GPIO_MCU_0_IN_3: IC402.173(PI4) ; port ISO_GPIO_MCU_0.IN_3
ISO_GPIO_MCU_0_OUT_0: IC402.152(PG9) ; port ISO_GPIO_MCU_0.OUT_0
ISO_GPIO_MCU_0_OUT_1: IC402.153(PG10) ; port ISO_GPIO_MCU_0.OUT_1
ISO_GPIO_MCU_0_OUT_2: IC402.174(PI5) ; port ISO_GPIO_MCU_0.OUT_2
ISO_GPIO_MCU_0_OUT_3: IC402.175(PI6) ; port ISO_GPIO_MCU_0.OUT_3
ISONOC_0_CONTROL: IC402.85(PH8) ; port ISONOC_CONTROL.0
ISONOC_1_CONTROL: IC402.86(PH9) ; port ISONOC_CONTROL.1
ISONOC_2_CONTROL: IC402.87(PH10) ; port ISONOC_CONTROL.2
ISONOC_3_CONTROL: IC402.88(PH11) ; port ISONOC_CONTROL.3
ISONOC_4_CONTROL: IC402.89(PH12) ; port ISONOC_CONTROL.4
ISONOC_5_CONTROL: IC402.99(PD11) ; port ISONOC_CONTROL.5
LSE_1_MCU_0: IC402.9(PC14-OSC32_IN(PC14)) ; sheet U_0403_crystals/LSE_1_MCU_0
LSE_2_MCU_0: IC402.10(PC15-OSC32_OUT(PC15)) ; sheet U_0403_crystals/LSE_2_MCU_0
MCU_0_NRESET: C425.1 IC402.31(NRST) R404.1 R405.1 S401.3 S401.4 X403.10
MCU_0_RTC_ALARM_OUT: IC402.8(PC13) X401.3
MCU_0_RTC_WAKEUP_IN: IC402.40(PA0-WKUP(PA0)) X401.2
MCU_0_SWCLK: IC402.137(PA14(JTCK-SWCLK)) X403.4
MCU_0_SWDIO: IC402.124(PA13(JTMS-SWDIO)) X403.2
MCU_0_SWO: IC402.161(PB3(JTDO/TRACESWO)) X403.6
MCU_0_TDI: IC402.138(PA15(JTDI)) X403.8
MCU_TO_FPGA_INTERFACE_MCU_0_CS: IC402.24(PF6) ; port MCU_TO_FPGA_INTERFACE.CS
MCU_TO_FPGA_INTERFACE_MCU_0_MISO: IC402.26(PF8) ; port MCU_TO_FPGA_INTERFACE.MISO
MCU_TO_FPGA_INTERFACE_MCU_0_MOSI: IC402.27(PF9) ; port MCU_TO_FPGA_INTERFACE.MOSI
MCU_TO_FPGA_INTERFACE_MCU_0_SCK: IC402.25(PF7) ; port MCU_TO_FPGA_INTERFACE.SCK
MCU_TO_MCU_INTERFACE_MCU_0_CS: IC402.92(PB12) ; port MCU_TO_MCU_MCU0.CS
MCU_TO_MCU_INTERFACE_MCU_0_MISO: IC402.94(PB14) ; port MCU_TO_MCU_MCU0.MISO
MCU_TO_MCU_INTERFACE_MCU_0_MOSI: IC402.95(PB15) ; port MCU_TO_MCU_MCU0.MOSI
MCU_TO_MCU_INTERFACE_MCU_0_SCK: IC402.145(PD3) ; port MCU_TO_MCU_MCU0.SCK
Memory_SUPPLY_CONTROL: IC402.33(PC1) ; port DATA_STORAGE_SPI.Memory_SUPPLY_CONTROL
RS485_MCU_0_DE: IC402.107(PG3) ; port RS485_MCU_0.DE
RS485_MCU_0_NRE: IC402.106(PG2) ; port RS485_MCU_0.NRE
RS485_MCU_0_RX: IC402.150(PD6) ; port RS485_MCU_0.RX
RS485_MCU_0_TX: IC402.42(PA2) ; port RS485_MCU_0.TX
TRACECLK_MCU_0: IC402.1(PE2) X403.12
TRACED0_MCU_0: IC402.2(PE3) X403.14
TRACED1_MCU_0: IC402.3(PE4) X403.16
TRACED2_MCU_0: IC402.4(PE5) X403.18
TRACED3_MCU_0: IC402.5(PE6) X403.20
NetC426_1: C426.1 IC402.125(VCAP_2)
NetC427_1: C427.1 IC402.81(VCAP_1)
NetIC402_58: IC402.58(PB2-BOOT1(PB2)) R407.2
NetR403_1: R403.1 R404.2
NetR406_2: R406.2 S401.1 S401.2

Not connected (* = marked no-connect by the designer): IC402 12(PI10)* 13(PI11)* 28(PF10)* 110(PG6)* 111(PG7)* 134(PI3)* 151(PD7)* 176(PI7)*; X403 7*

### Buses and harness runs
bus ADC_MCU_0_CH_[0..4] = port ADC_MCU_0_CH_[0..4]
bus BMS-INTERFACE_0_GPIO_[0..3]
bus FMC_MCU_0_RAM_A[0..11]
bus FMC_MCU_0_RAM_BA[0..1]
bus FMC_MCU_0_RAM_D[0..15]
bus FMC_MCU_0_RAM_NBL[0..1]

### Notes on the sheet
- (near X403) ARM Cortex Debug Connector 1.27mm
- (near X401) Wakeup connector (optional)
- Fraunhofer IISB
- Schottkystr. 10
- developed by:
- 91058 Erlangen
- Germany
- Author
- Project
- License
- Description
- File
- Version
- Release Date
- Sheet
- www.foxbms.org
- www.iisb.fraunhofer.de
- foxBMS Team
- /

### Library data of the parts
C425 C430 = gen_C_ceramic_100n_50V_X7R_0603: as C2101 on sheet FPGA_SPI_interface; Part Number: gen_C_ceramic_100n_50V_X7R_0603; Supplier 1: Farnell; Supplier Part Number 1: 2525267; Supplier 2: Digikey; Supplier Part Number 2: 490-6049-1-ND
C426 C427 = gen_C_ceramic_2u2_10V_X5R_0603: MLCC; Capacitance: 2u2; Rated Voltage: 10V; Dielectric: X5R; Case EIA: 0603; Case Metric: 1608; AVT Set: x; Automotive Qualified: False; Part Number: gen_C_ceramic_2u2_10V_X5R_0603; Supplier 1: Farnell; Supplier Part Number 1: 2320817
IC402 = CMP-0243-00078-2: ARM Cortex-M4 32-bit MCU+FPU, 225 DMIPS, 2048 kB Flash, 256 kB Internal RAM, 140 I/Os, 176-pin LQFP, -40 to 85 degC, Tray; Manufacturer: STMicroelectronics; Internal RAM Size (kB): 256; I/Os (High Current): 140; FLASH Size (Prog) (kB): 2048; D/A Converter: 2x12-bit; Supply Voltage(Vcc) max (V): 3.6; Operating Frequency(F) (Processor speed) (MHz): 180; Supply Voltage(Vcc) min (V): 1.8; Core: ARM Cortex-M4; PackageReference: LQFP176; ComponentLink1Description: Manufacturer URL; Packing: Tray; ComponentLink2Description: Datasheet; ComponentLink3Description: Package Specification; ComponentLink2URL: http://www.st.com/st-web-ui/static/active/en/resource/technical/document/data_brief/DM00053488.pdf; PackageVersion: Rev. 4, 06/2013; ComponentLink1URL: http://www.st.com/web/en/home.html; DatasheetVersion: Rev. 2; PartNumber: STM32F429IIT6; PackageDescription: 176-Pin Low Profile Quad Flat Package, 24 x 24 mm Body, 0.5 mm Pitch; ComponentLink3URL: http://www.st.com/st-web-ui/static/active/en/resource/technical/document/datasheet/DM00035129.pdf; Mounting Technology: Surface Mount
R403 R406 = gen_R_0R_0603: SMD Resistor 0R 0603; Power: 0.1W; Case EIA: 0603; Case Metric: 1608; PnP Package: R_0603; Maximum Working Voltage: 75V; Automotive Qualified: False; Part Number: gen_R_0R_0603; Operating Temperature: -55°C - +155°C; Resistance: 0R; Series: Jumper; PnP Value: 0R; Supplier 1: Farnell; Supplier Part Number 1: 2073345
R404 = gen_R_680R_0603: SMD Resistor 680R 0603; Tolerance: 1%; Power: 0.1W; Case EIA: 0603; Case Metric: 1608; Maximum Working Voltage: 75V; PnP Package: R_0603; Automotive Qualified: False; Part Number: gen_R_680R_0603; Operating Temperature: -55°C - +155°C; Resistance: 680R; Series: E24; PnP Value: 680R; Supplier 1: Farnell; Supplier Part Number 1: 2797303
R405 R407 = gen_R_10k_0603: SMD Resistor 10k 0603; Tolerance: 1%; Power: 0.1W; Case EIA: 0603; Case Metric: 1608; Maximum Working Voltage: 75V; PnP Package: R_0603; Automotive Qualified: False; Part Number: gen_R_10k_0603; Operating Temperature: -55°C - +155°C; Resistance: 10k; Series: E24, E96; PnP Value: 10k; Supplier 1: Farnell; Supplier Part Number 1: 2073349
S401 = KMR221GLFS: Microminiature Tactile Switch; Manufacturer: CK Components; Automotive Qualified: False; Part Number: KMR221GLFS; Operating Temperature: -40°C - +85°C; ComponentLink1Description: Datasheet; ComponentLink1URL: http://www.farnell.com/datasheets/1685525.pdf; Supplier 1: Farnell; Supplier Part Number 1: 1201424; Supplier 2: Digikey; Supplier Part Number 2: 401-1426-1-ND; Supplier 3: Mouser; Supplier Part Number 3: 611-KMR211G-LFS
X401 = samtec_TSW-103-07-G-S: Board-To-Board Connector, Vertical, 2.54 mm, 3 Contacts, Header, TSW Series, Through Hole, 1 Row; Manufacturer: Samtec; Circuits: 3; Automotive Qualified: False; Part Number: samtec_TSW-103-07-G-S; Part Name: TSW-103-07-G-S; Operating Temperature: -55°C - +125°C; ComponentLink1Description: Datasheet; ComponentLink1URL: http://www.farnell.com/datasheets/1796313.pdf; Supplier 1: Farnell; Supplier Part Number 1: 2505045
X403 = samtec_FTSH-110-01-L-DV-007-K-P: Board-To-Board Connector, ARM Cortex Debug Header 20 Pin; Manufacturer: Samtec; Circuits: 20; Automotive Qualified: False; Part Number: samtec_FTSH-110-01-L-DV-007-K-P; Part Name: FTSH-110-01-L-DV-007-K-P; Operating Temperature: -55°C - +125°C; Supplier 1: Digikey; Supplier Part Number 1: SAM11268-ND; Supplier 2: Avnet; Supplier Part Number 2: FTSH-110-01-L-DV-007-K-P

## Sheet crystals.SchDoc
size A3; DocumentNumber: 8; SheetNumber: 8; SheetTotal: 24; SheetDescription: Crystals for MCU0
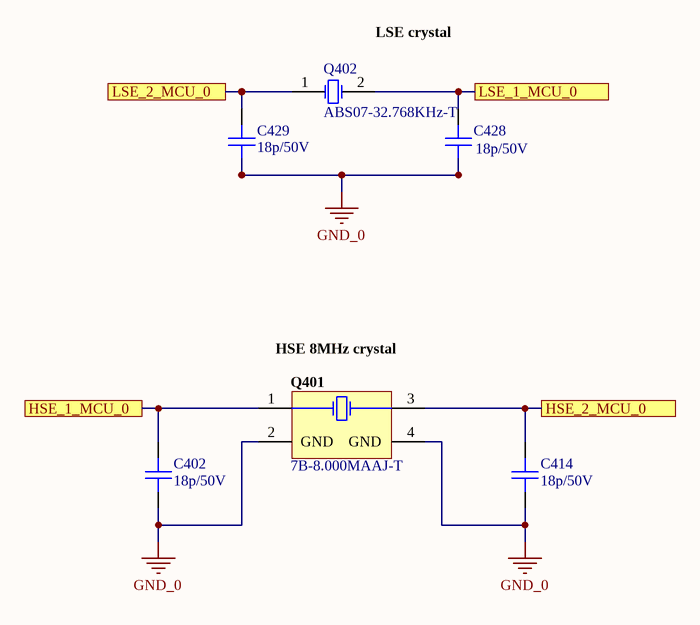
[diagram p5: crystals.SchDoc]

### Parts
C402  18p/50V  [CAPC1608X08N]
C414  18p/50V  [CAPC1608X08N]
C428  18p/50V  [CAPC1608X08N]
C429  18p/50V  [CAPC1608X08N]
Q401  7B-8.000MAAJ-T  [TXC-7B-4_V]
Q402  ABS07-32.768KHz-T  [ABRA-ABS07-2_V]

### Ports
HSE_1_MCU_0, HSE_2_MCU_0, LSE_1_MCU_0, LSE_2_MCU_0

### Nets
GND_0: C402.1 C414.2 C428.1 C429.2 Q401.2(GND) Q401.4(GND)
HSE_1_MCU_0: C402.2 Q401.1(X1) ; port HSE_1_MCU_0
HSE_2_MCU_0: C414.1 Q401.3(X2) ; port HSE_2_MCU_0
LSE_1_MCU_0: C428.2 Q402.2(X2) ; port LSE_1_MCU_0
LSE_2_MCU_0: C429.1 Q402.1(X1) ; port LSE_2_MCU_0

### Notes on the sheet
- (near Q402) LSE crystal
- (near Q401) HSE 8MHz crystal
- Fraunhofer IISB
- Schottkystr. 10
- developed by:
- 91058 Erlangen
- Germany
- Author
- Project
- License
- Description
- File
- Version
- Release Date
- Sheet
- www.foxbms.org
- www.iisb.fraunhofer.de
- foxBMS Team
- /

### Library data of the parts
C402 C414 C428 C429 = gen_C_ceramic_18p_50V_C0G_0603: MLCC; Capacitance: 18p; Rated Voltage: 50V; Dielectric: C0G; Case EIA: 0603; Case Metric: 1608; Automotive Qualified: False; Part Number: gen_C_ceramic_18p_50V_C0G_0603; Supplier 1: Farnell; Supplier Part Number 1: 2070403
Q401 = CMP-1774-00004-1: SMD Seam Sealing Crystal, 8 MHz, +/- 30 ppm, 18 pF, -10 to 70 degC, 4-Pin SMD, RoHS, Tape and Reel; Power Rating: 100 mW; Case\Package: 0603; Voltage Rating: 50 V; Tolerance: 1%; Resistance: 150 Ohm; Package Quantity: 5000; Case Code (Metric): 1608; Packaging: Tape and Reel; Length: 1.6 mm; RoHSCompliant: true; REACH SVHC: No SVHC; Mount: Surface Mount; Case Code (Imperial): 0603; Pins: 2; Width: 0.8 mm; PackageDescription: 4-Pin Surface Mount Device, Body 5 x 3.2 mm, Pitch 3.7 mm; ComponentLink1Description: Datasheet; DatasheetVersion: Jul-15; ComponentLink1URL: http://www.txccorp.com/download/products/quartz_crystals/2015TXC_7B_19.pdf; PackageReference: 7B-4; Height: 0.45 mm; Max Operating Temperature: 155 degC; Min Operating Temperature: -55 degC; Voltage Rating (DC): 50 V
Q402 = CMP-0447-00001-2: Crystal, 32.768 kHz, 12.5 pF, -40 to 85 degC, SMD Low Profile 3.2 x 1.5 x 0.9 mm, Tape and Reel; Manufacturer: Abracon; Q Value (Type): 30000; Operation Mode: Flexural Mode (Tuning Fork); Shunt Capacitance (C0): 0.9 to 1.2 pF; Load Capacitance (CL): 12.5 pF; Frequency Tolerance @+25degC: +/- 20 ppm; Drive Level (Type): 0.1 uW; Equivalent Series Resistance (R1): 70 Kohm; Insulation Resistance (Min): 500 Mohm; ComponentLink3URL: http://www.abracon.com/Resonators/ABS07.pdf; PackageDescription: 2-Pin Hand Drawn, Body 3.2x1.5mm, Pitch 2.5mm; Operating Temperature: -40 to 85 degC; ComponentLink2URL: http://www.abracon.com/Resonators/ABS07.pdf; PackageReference: ABS07-2; ComponentLink3Description: Package Specification; ComponentLink1Description: Manufacturer URL; DatasheetVersion: 04.03.13; Mounting Technology: Surface Mount; ComponentLink2Description: Datasheet; ComponentLink1URL: http://www.abracon.com/; PartNumber: ABS07-32.768KHz-T; Packing: Tape and Reel; Frequency: 32.768 kHz

## Sheet debug_LED.SchDoc
size A3; DocumentNumber: 9; SheetNumber: 9; SheetTotal: 24; SheetDescription: Debug LEDs for MCU0
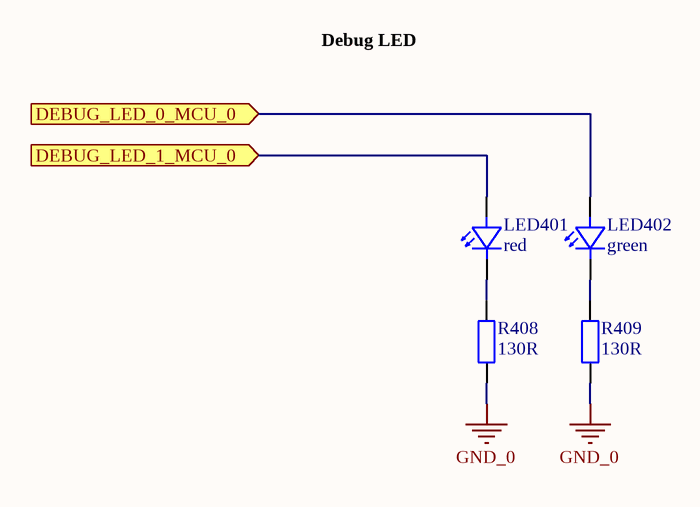
[diagram p6: debug_LED.SchDoc]

### Parts
LED401  red  [LEDC1608X07N]
LED402  green  [LEDC1608X07N]
R408  130R  [RESC1608X05N]
R409  130R  [RESC1608X05N]

### Ports
DEBUG_LED_0_MCU_0 (in), DEBUG_LED_1_MCU_0 (in)

### Nets
GND_0: R408.1 R409.1
DEBUG_LED_0_MCU_0: LED402.2(A) ; port DEBUG_LED_0_MCU_0
DEBUG_LED_1_MCU_0: LED401.2(A) ; port DEBUG_LED_1_MCU_0
NetLED401_1: LED401.1(C) R408.2
NetLED402_1: LED402.1(C) R409.2

### Notes on the sheet
- Debug LED
- Fraunhofer IISB
- Schottkystr. 10
- developed by:
- 91058 Erlangen
- Germany
- Author
- Project
- License
- Description
- File
- Version
- Release Date
- Sheet
- www.foxbms.org
- www.iisb.fraunhofer.de
- foxBMS Team
- /

### Library data of the parts
LED401 = gen_LED_0603_red: LED; Breakdown Voltage: 5V; Continuous Forward Current: 20mA; Forward Voltage @ 20mA: 2V; Automotive Qualified: False; Part Number: gen_LED_0603_red; Color: red; PnP Package: LED_0603; Supplier 1: Farnell; Supplier Part Number 1: 2099221
LED402 = gen_LED_0603_green: LED; Breakdown Voltage: 5V; Continuous Forward Current: 20mA; Forward Voltage @ 20mA: 2.2V; Automotive Qualified: False; Part Number: gen_LED_0603_green; Color: green; PnP Package: LED_0603; Supplier 1: Farnell; Supplier Part Number 1: 2099223
R408 R409 = gen_R_130R_0603: as R201 on sheet supply0; Part Number: gen_R_130R_0603; Operating Temperature: -55°C - +155°C; Resistance: 130R; Series: E24, E96; PnP Value: 130R; Supplier 1: Farnell; Supplier Part Number 1: 2379959

## Sheet ext_bootload_activation.SchDoc
size A3; DocumentNumber: 10; SheetNumber: 10; SheetTotal: 24; SheetDescription: External Bootload Activation Circuit
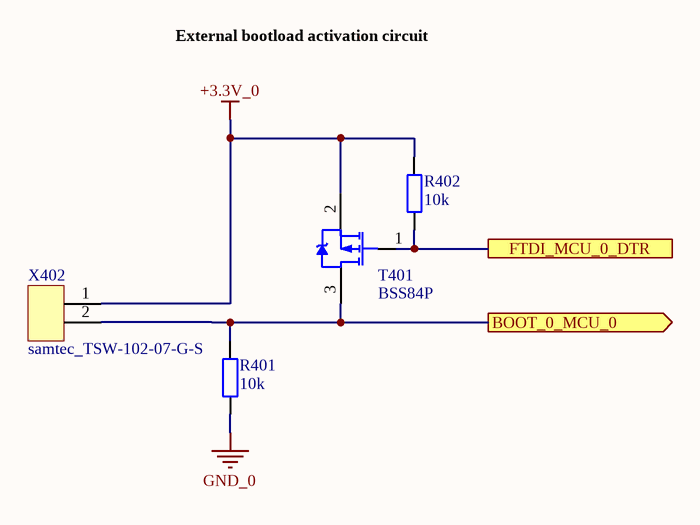
[diagram p7: ext_bootload_activation.SchDoc]

### Parts
R401  10k  [RESC1608X05N]
R402  10k  [RESC1608X05N]
T401  BSS84P  [INF-PG-SOT23_N]
X402  samtec_TSW-102-07-G-S  [Pinheader_2.54_2]

### Ports
BOOT_0_MCU_0 (out), FTDI_MCU_0_DTR

### Nets
+3.3V_0: R402.2 T401.2(SOURCE) X402.1
GND_0: R401.1
BOOT_0_MCU_0: R401.2 T401.3(DRAIN) X402.2 ; port BOOT_0_MCU_0
FTDI_MCU_0_DTR: R402.1 T401.1(GATE) ; port FTDI_MCU_0_DTR

### Notes on the sheet
- External bootload activation circuit
- Fraunhofer IISB
- Schottkystr. 10
- developed by:
- 91058 Erlangen
- Germany
- Author
- Project
- License
- Description
- File
- Version
- Release Date
- Sheet
- www.foxbms.org
- www.iisb.fraunhofer.de
- foxBMS Team
- /

### Library data of the parts
R401 R402 = gen_R_10k_0603: as R405 on sheet mcu0_primary; Part Number: gen_R_10k_0603; Operating Temperature: -55°C - +155°C; Resistance: 10k; Series: E24, E96; PnP Value: 10k; Supplier 1: Farnell; Supplier Part Number 1: 2073349
T401 = CMP-1099-00028-1: P-Channel SIPMOS Small-Signal-Transistor, -60 V VDS, -0.17 A ID, -55 to 150 degC, PG-SOT23, Reel, Green; Manufacturer: Infineon; VGS(th) (max): -2Â V; VGS(th) (min): -1Â V; VDS (max): -60Â V; Rth: 350Â K/W; Pto t (max): 0.36Â W; ID (max): -0.17Â A; IDpuls (max): -0.68Â A; RDS (on) (max) (@4.5V): 12,000Â mOhm; QG: 1Â nC; Green: TRUE; RDS (on) (max): 8,000Â mOhm; ComponentLink3URL: http://www.infineon.com/dgdl/SOT23-Package_Overview.pdf?folderId=db3a30431936bc4b0119532290053c66&fileId=db3a30431936bc4b0119533468123c85; ComponentLink3Description: Package Specification; Packing: Reel; PartNumber: BSS84P; ComponentLink2Description: Datasheet; Mounting Technology: Surface Mount; ComponentLink2URL: http://www.infineon.com/dgdl/BSS84P_Rev2.7%5B1%5D.pdf?folderId=db3a304314dca38901154a72e3951a65&fileId=db3a304330f68606013118ac7a9b4549; PackageReference: PG-SOT23; ComponentLink1URL: http://www.infineon.com/; PackageVersion: Apr-08; ComponentLink1Description: Manufacturer URL; PackageDescription: 3-Pin Small Outline Transistor Package, 2.9 x 1.3 mm Body, 0.95 mm Pitch; Halogen-free: TRUE; DatasheetVersion: Rev. 2.7
X402 = samtec_TSW-102-07-G-S: Board-To-Board Connector, Vertical, 2.54 mm, 2 Contacts, Header, TSW Series, Through Hole, 1 Row; Manufacturer: Samtec; Circuits: 2; Automotive Qualified: False; Part Number: samtec_TSW-102-07-G-S; Part Name: TSW-102-07-G-S; Operating Temperature: -55°C - +125°C; ComponentLink1Description: Datasheet; ComponentLink1URL: http://www.farnell.com/datasheets/1796313.pdf; Supplier 1: Farnell; Supplier Part Number 1: 2505044

## Sheet power.SchDoc
size A3; DocumentNumber: 5; SheetNumber: 5; SheetTotal: 24; SheetDescription: Decoupling and references for MCU0
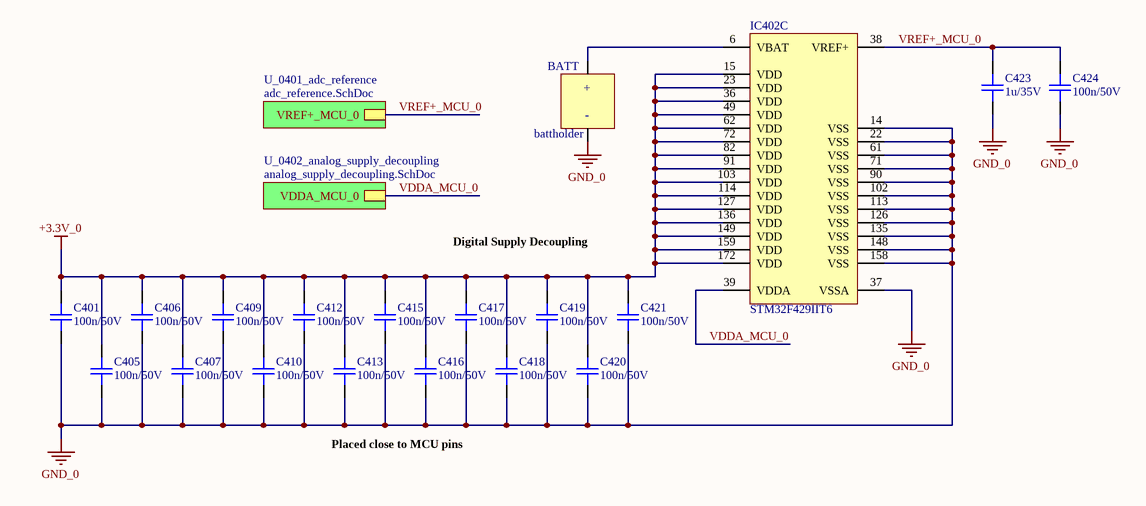
[diagram p8: power.SchDoc]

### Parts
BATT  battholder  [SMTU_1225-1-LF]
C401  100n/50V  [CAPC1608X08N]
C405  100n/50V  [CAPC1608X08N]
C406  100n/50V  [CAPC1608X08N]
C407  100n/50V  [CAPC1608X08N]
C409  100n/50V  [CAPC1608X08N]
C410  100n/50V  [CAPC1608X08N]
C412  100n/50V  [CAPC1608X08N]
C413  100n/50V  [CAPC1608X08N]
C415  100n/50V  [CAPC1608X08N]
C416  100n/50V  [CAPC1608X08N]
C417  100n/50V  [CAPC1608X08N]
C418  100n/50V  [CAPC1608X08N]
C419  100n/50V  [CAPC1608X08N]
C420  100n/50V  [CAPC1608X08N]
C421  100n/50V  [CAPC1608X08N]
C423  1u/35V  [CAPC1608X08N]
C424  100n/50V  [CAPC1608X08N]
IC402  STM32F429IIT6  [STM-LQFP176_N]  (part C of 3)

### Sub-sheets
U_0401_adc_reference = adc_reference.SchDoc: VREF+_MCU_0
U_0402_analog_supply_decoupling = analog_supply_decoupling.SchDoc: VDDA_MCU_0

### Nets
+3.3V_0: C401.1 C405.1 C406.1 C407.1 C409.1 C410.1 C412.1 C413.1 C415.1 C416.1 C417.1 C418.1 C419.1 C420.1 C421.1 IC402.15(VDD) IC402.23(VDD) IC402.36(VDD) IC402.49(VDD) IC402.62(VDD) IC402.72(VDD) IC402.82(VDD) IC402.91(VDD) IC402.103(VDD) IC402.114(VDD) IC402.127(VDD) IC402.136(VDD) IC402.149(VDD) IC402.159(VDD) IC402.172(VDD)
GND_0: BATT.- C401.2 C405.2 C406.2 C407.2 C409.2 C410.2 C412.2 C413.2 C415.2 C416.2 C417.2 C418.2 C419.2 C420.2 C421.2 C423.2 C424.2 IC402.14(VSS) IC402.22(VSS) IC402.37(VSSA) IC402.61(VSS) IC402.71(VSS) IC402.90(VSS) IC402.102(VSS) IC402.113(VSS) IC402.126(VSS) IC402.135(VSS) IC402.148(VSS) IC402.158(VSS)
VDDA_MCU_0: IC402.39(VDDA) ; sheet U_0402_analog_supply_decoupling/VDDA_MCU_0
VREF+_MCU_0: C423.1 C424.1 IC402.38(VREF+) ; sheet U_0401_adc_reference/VREF+_MCU_0
NetBATT_+: BATT.+ IC402.6(VBAT)

### Notes on the sheet
- Digital Supply Decoupling
- Placed close to MCU pins
- Fraunhofer IISB
- Schottkystr. 10
- developed by:
- 91058 Erlangen
- Germany
- Author
- Project
- License
- Description
- File
- Version
- Release Date
- Sheet
- www.foxbms.org
- www.iisb.fraunhofer.de
- foxBMS Team
- /

### Library data of the parts
BATT = Batt_Holder_SMTU_1225-1-LF: SMTU 1225-1-LF, Battery Holder 1225; Manufacturer: Renata; Automotive Qualified: False; Part Number: Batt_Holder_SMTU_1225-1-LF; Operating Temperature: - / -40°C - +100°C; ComponentLink1Description: Datasheet; ComponentLink1URL: http://www.farnell.com/datasheets/1766152.pdf; Supplier 1: Farnell; Supplier Part Number 1: 1216353
C401 C405-C407 C409 C410 C412 C413 C415-C421 C424 = gen_C_ceramic_100n_50V_X7R_0603: as C2101 on sheet FPGA_SPI_interface; Part Number: gen_C_ceramic_100n_50V_X7R_0603; Supplier 1: Farnell; Supplier Part Number 1: 2525267; Supplier 2: Digikey; Supplier Part Number 2: 490-6049-1-ND
C423 = gen_C_ceramic_1u_35V_X7R_0603: as C205 on sheet supply0; Part Number: gen_C_ceramic_1u_35V_X7R_0603; Supplier 1: Farnell; Supplier Part Number 1: 1907508
IC402 = CMP-0243-00078-2: as IC402 on sheet mcu0_primary; Core: ARM Cortex-M4; PackageReference: LQFP176; ComponentLink1Description: Manufacturer URL; Packing: Tray; ComponentLink2Description: Datasheet; ComponentLink3Description: Package Specification; ComponentLink2URL: http://www.st.com/st-web-ui/static/active/en/resource/technical/document/data_brief/DM00053488.pdf; PackageVersion: Rev. 4, 06/2013; ComponentLink1URL: http://www.st.com/web/en/home.html; DatasheetVersion: Rev. 2; PartNumber: STM32F429IIT6; PackageDescription: 176-Pin Low Profile Quad Flat Package, 24 x 24 mm Body, 0.5 mm Pitch; ComponentLink3URL: http://www.st.com/st-web-ui/static/active/en/resource/technical/document/datasheet/DM00035129.pdf; Mounting Technology: Surface Mount

## Sheet adc_reference.SchDoc
size A3; DocumentNumber: 6; SheetNumber: 6; SheetTotal: 24; SheetDescription: ADC Reference for MCU0
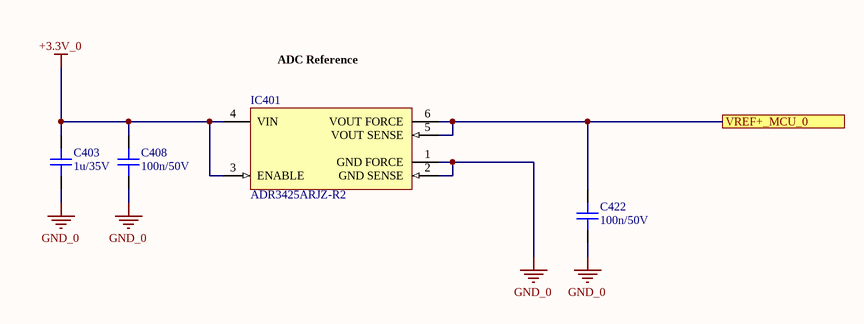
[diagram p9: adc_reference.SchDoc]

### Parts
C403  1u/35V  [CAPC1608X08N]
C408  100n/50V  [CAPC1608X08N]
C422  100n/50V  [CAPC1608X08N]
IC401  ADR3425ARJZ-R2  [ADI-RJ-6_N]

### Ports
VREF+_MCU_0

### Nets
+3.3V_0: C403.1 C408.1 IC401.3(ENABLE) IC401.4(VIN)
GND_0: C403.2 C408.2 C422.2 IC401.1(GND_FORCE) IC401.2(GND_SENSE)
VREF+_MCU_0: C422.1 IC401.5(VOUT_SENSE) IC401.6(VOUT_FORCE) ; port VREF+_MCU_0

### Notes on the sheet
- ADC Reference
- Fraunhofer IISB
- Schottkystr. 10
- developed by:
- 91058 Erlangen
- Germany
- Author
- Project
- License
- Description
- File
- Version
- Release Date
- Sheet
- www.foxbms.org
- www.iisb.fraunhofer.de
- foxBMS Team
- /

### Library data of the parts
C403 = gen_C_ceramic_1u_35V_X7R_0603: as C205 on sheet supply0; Part Number: gen_C_ceramic_1u_35V_X7R_0603; Supplier 1: Farnell; Supplier Part Number 1: 1907508
C408 C422 = gen_C_ceramic_100n_50V_X7R_0603: as C2101 on sheet FPGA_SPI_interface; Part Number: gen_C_ceramic_100n_50V_X7R_0603; Supplier 1: Farnell; Supplier Part Number 1: 2525267; Supplier 2: Digikey; Supplier Part Number 2: 490-6049-1-ND
IC401 = CMP-0784-00366-1: Micropower, High Accuracy Voltage Reference, 2.5 V Output, 2.7 to 5.5 V Supply, Industrial, 6-pin SOT23 (RJ-6), Reel; Manufacturer: Analog Devices; Vout: 2.5V; Ref Out TC (ppm/C): 2.5; Min V Supply (V): 2.7; Max V Supply (V): 5.5; ComponentLink3URL: http://www.analog.com/static/imported-files/packages/PKG_PDF/SOT-23(RJ)/RJ_6.pdf; Mounting Technology: Surface Mount; Packing: Reel; ComponentLink3Description: Package Specification; Code_JEDEC: MO-178-AB; PackageReference: RJ-6; Operating Temp Range: -40 to 125 degC; PartNumber: ADR3425ARJZ-R2; ComponentLink2Description: Datasheet; PackageDescription: 6-Pin Small Outline Transistor Package, Body 2.9 x 1.6 mm, Pitch 0.95 mm; ComponentLink1URL: http://www.analog.com/en/index.html; ComponentLink2URL: http://www.analog.com/static/imported-files/data_sheets/ADR3412_ADR3420_ADR3425_ADR3430_ADR3433_ADR3440_ADR3450.pdf; ComponentLink1Description: Manufacturer URL; PackageVersion: 121608-A, 12/2008; ComponentLink4URL: Product URL:http://www.analog.com/en/special-linear-functions/voltage-references/adr3425/products/product.html; ComponentLink4Description: URL Link1; DatasheetVersion: Rev. B